# EAGLE board distribution_board_v3 (EAGLE 8.4.2)
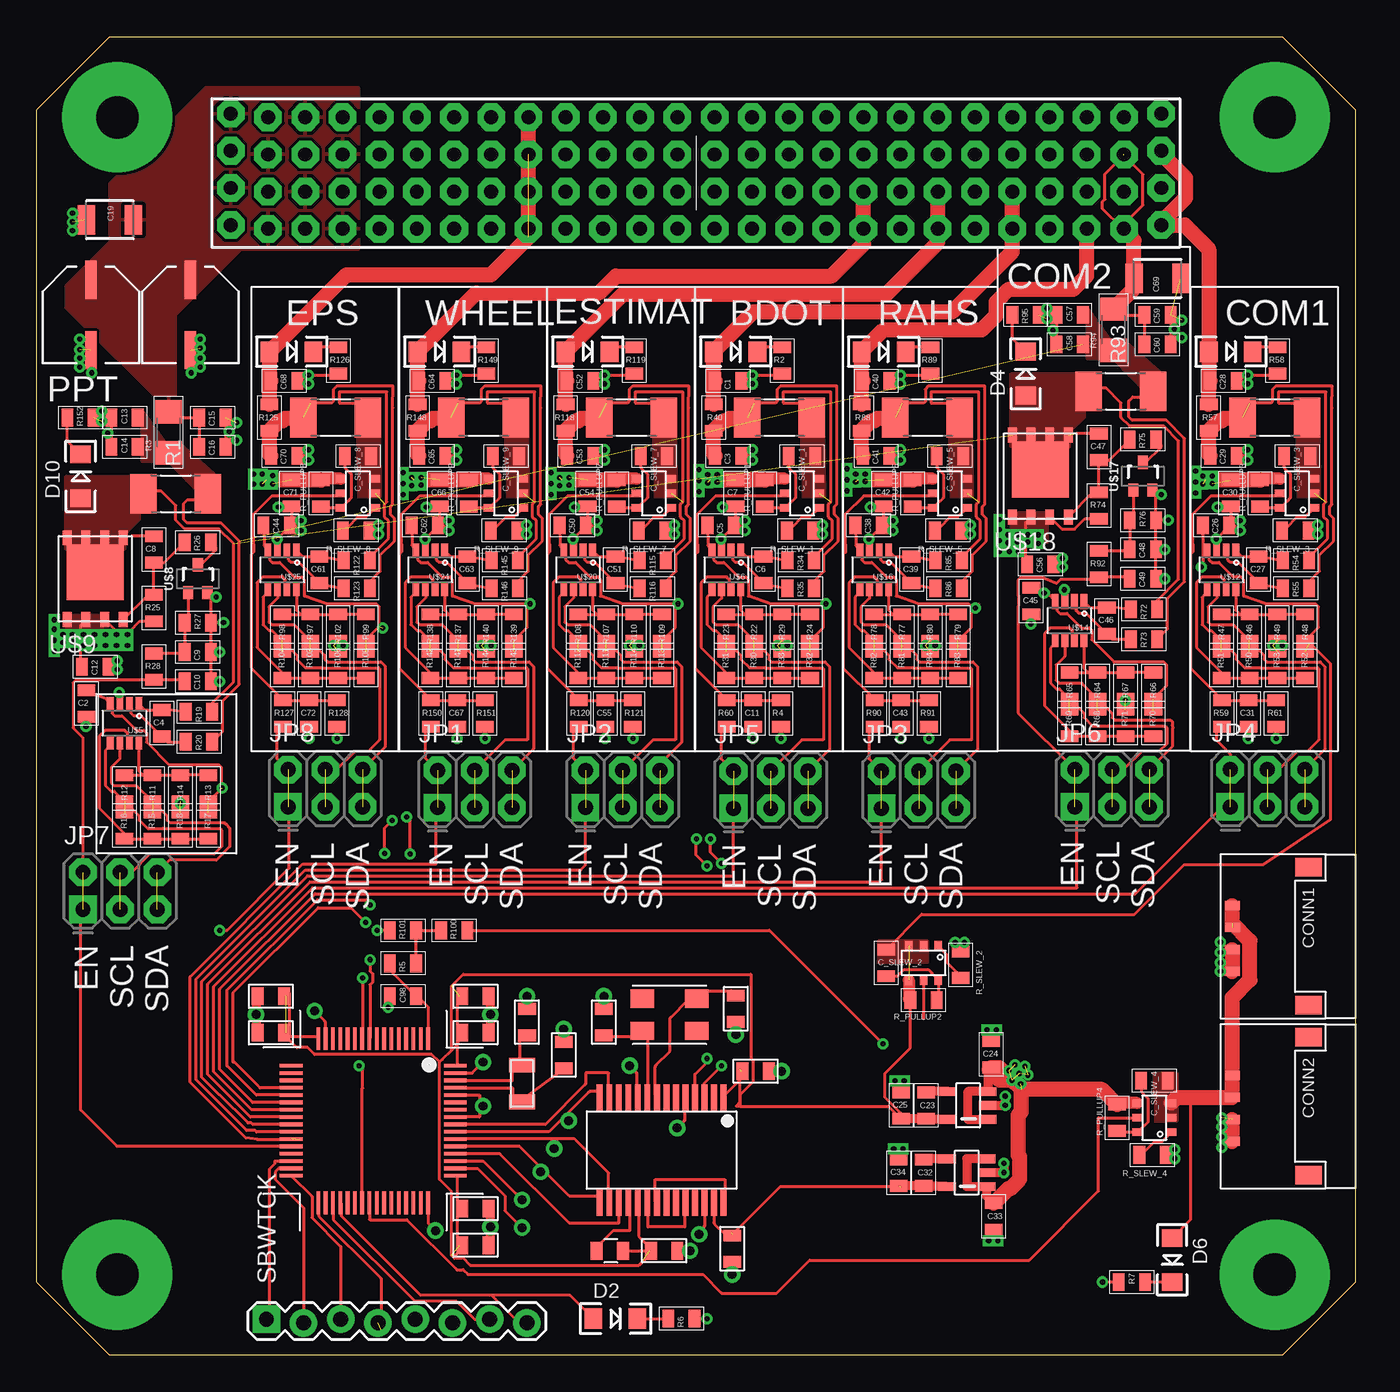
[diagram p3: board, top side]
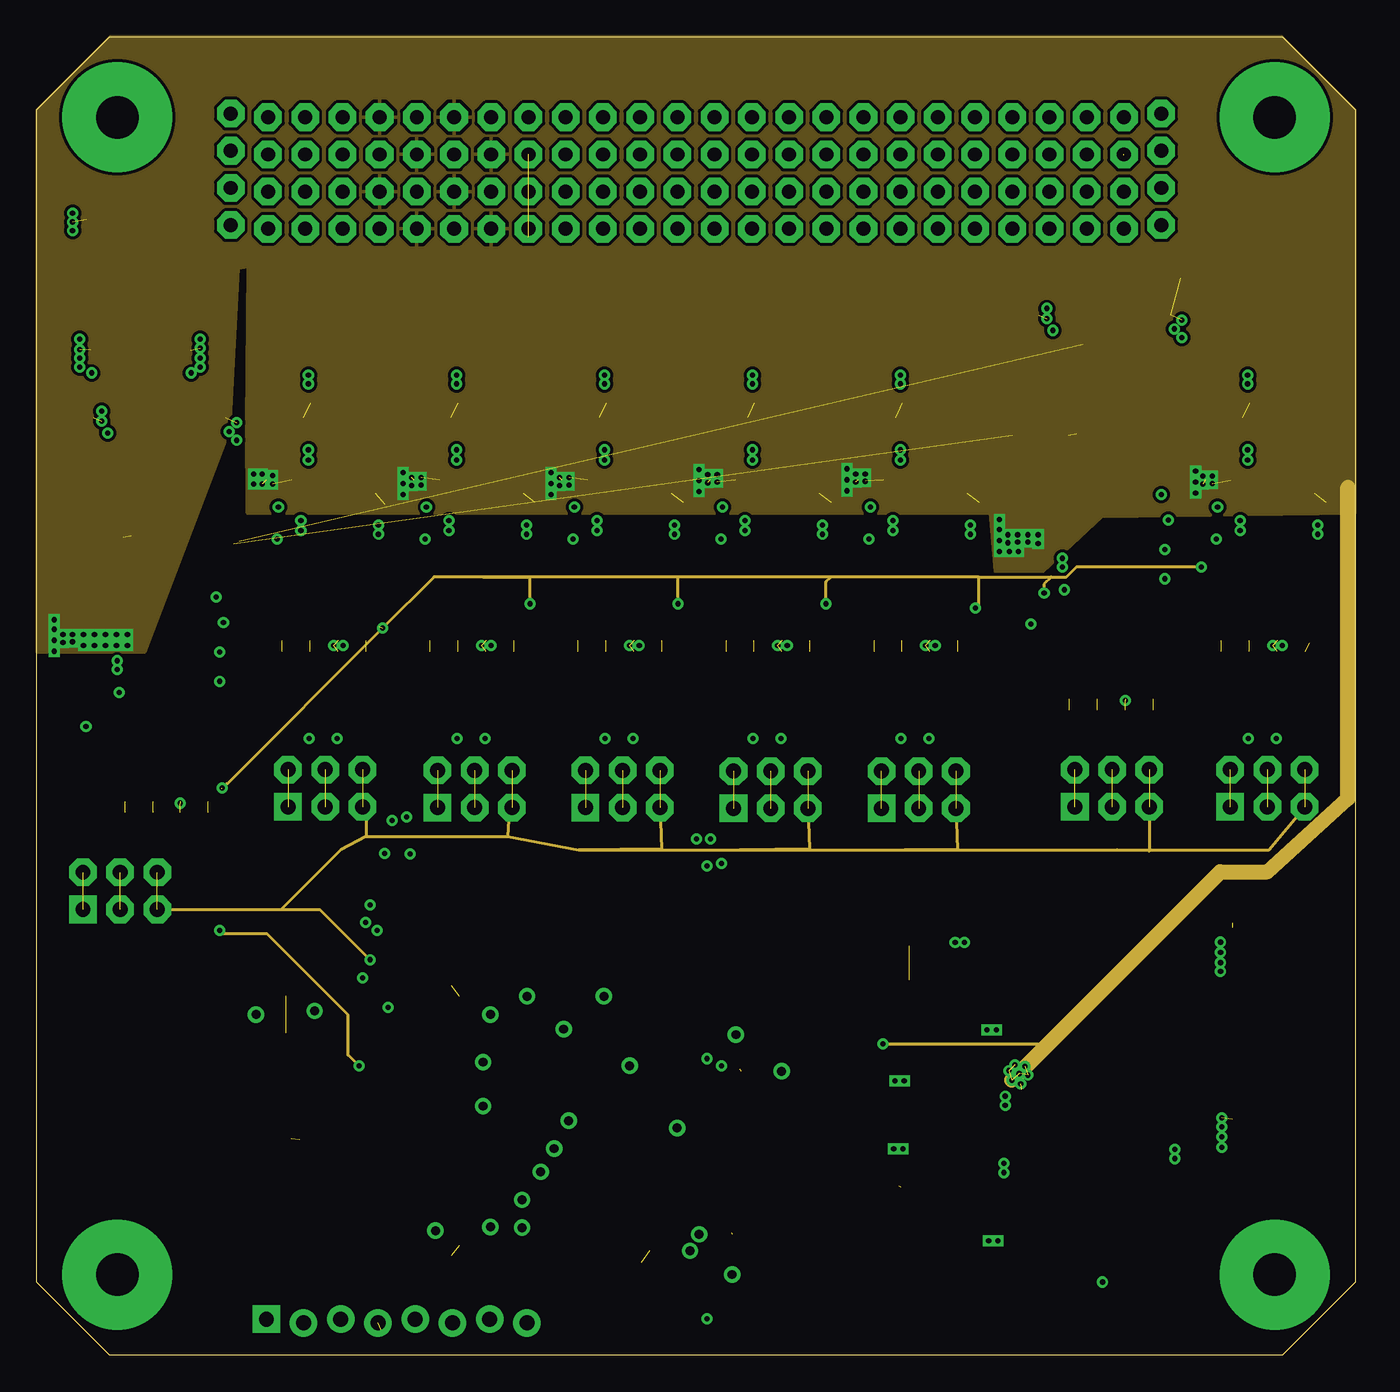
[diagram p4: board, inner layer Route2]
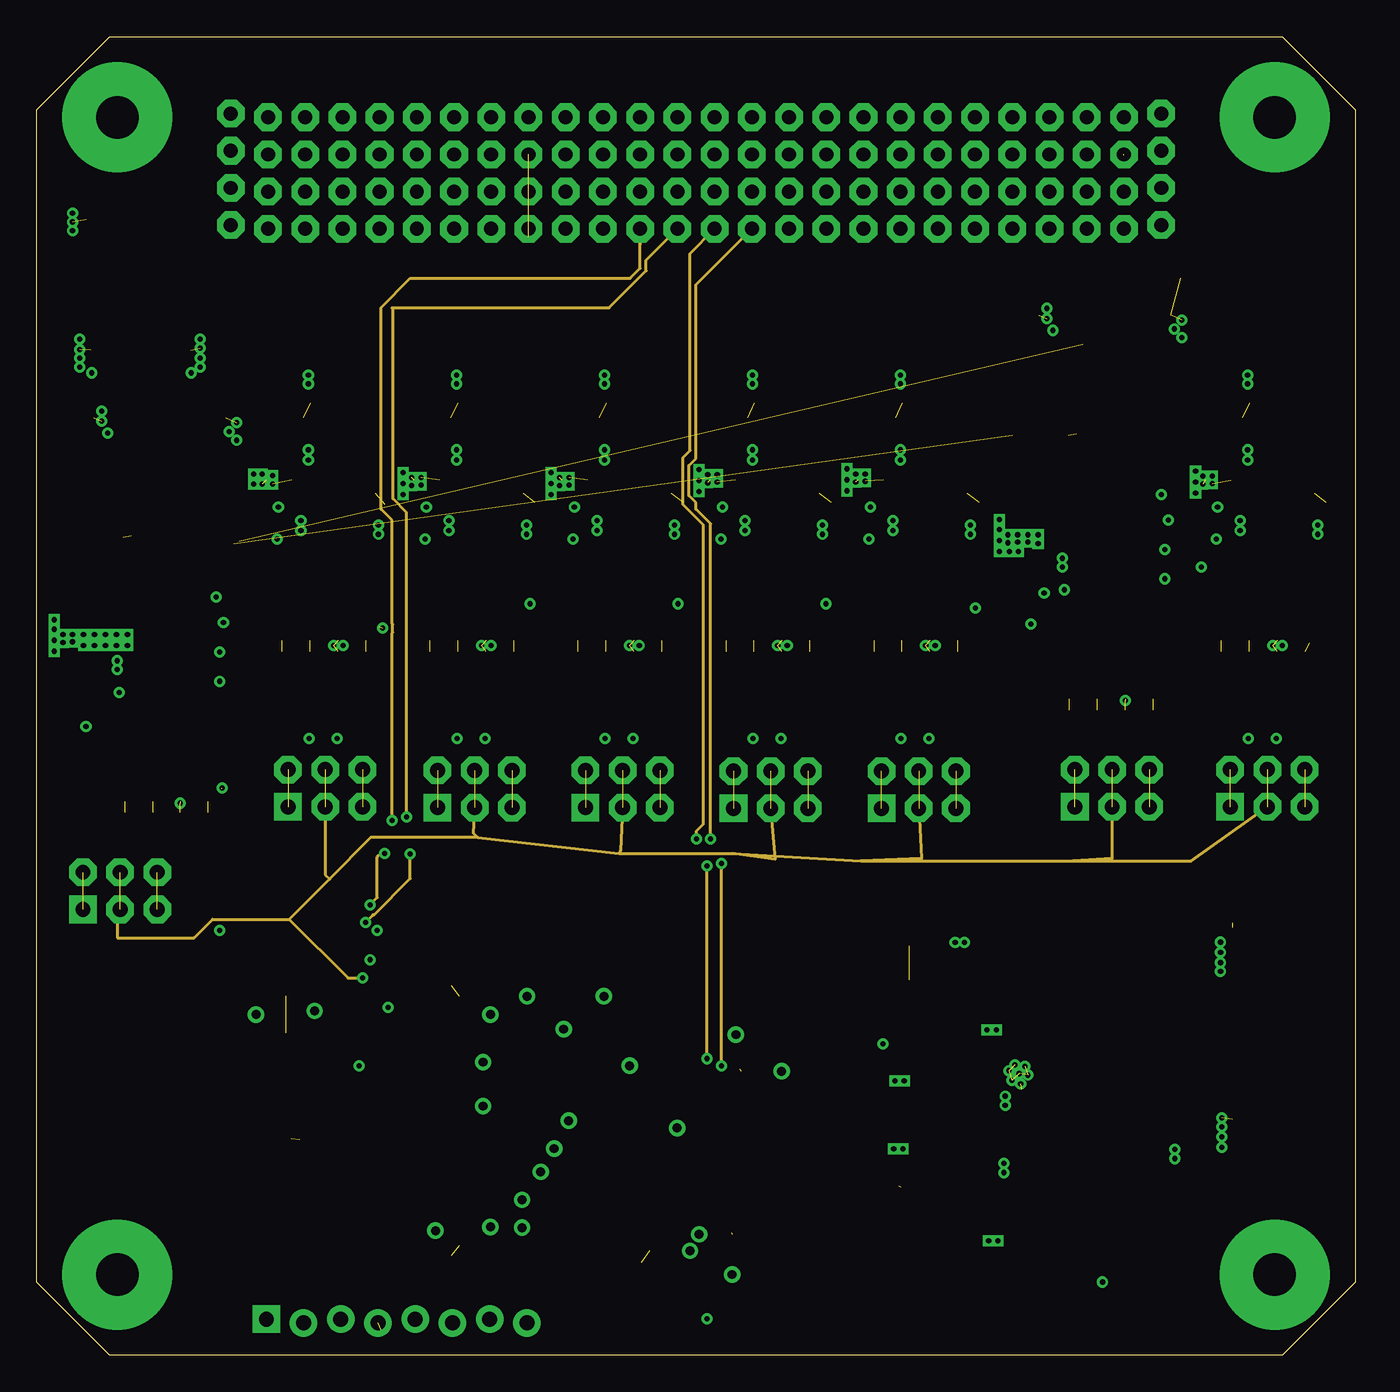
[diagram p5: board, inner layer Route3]
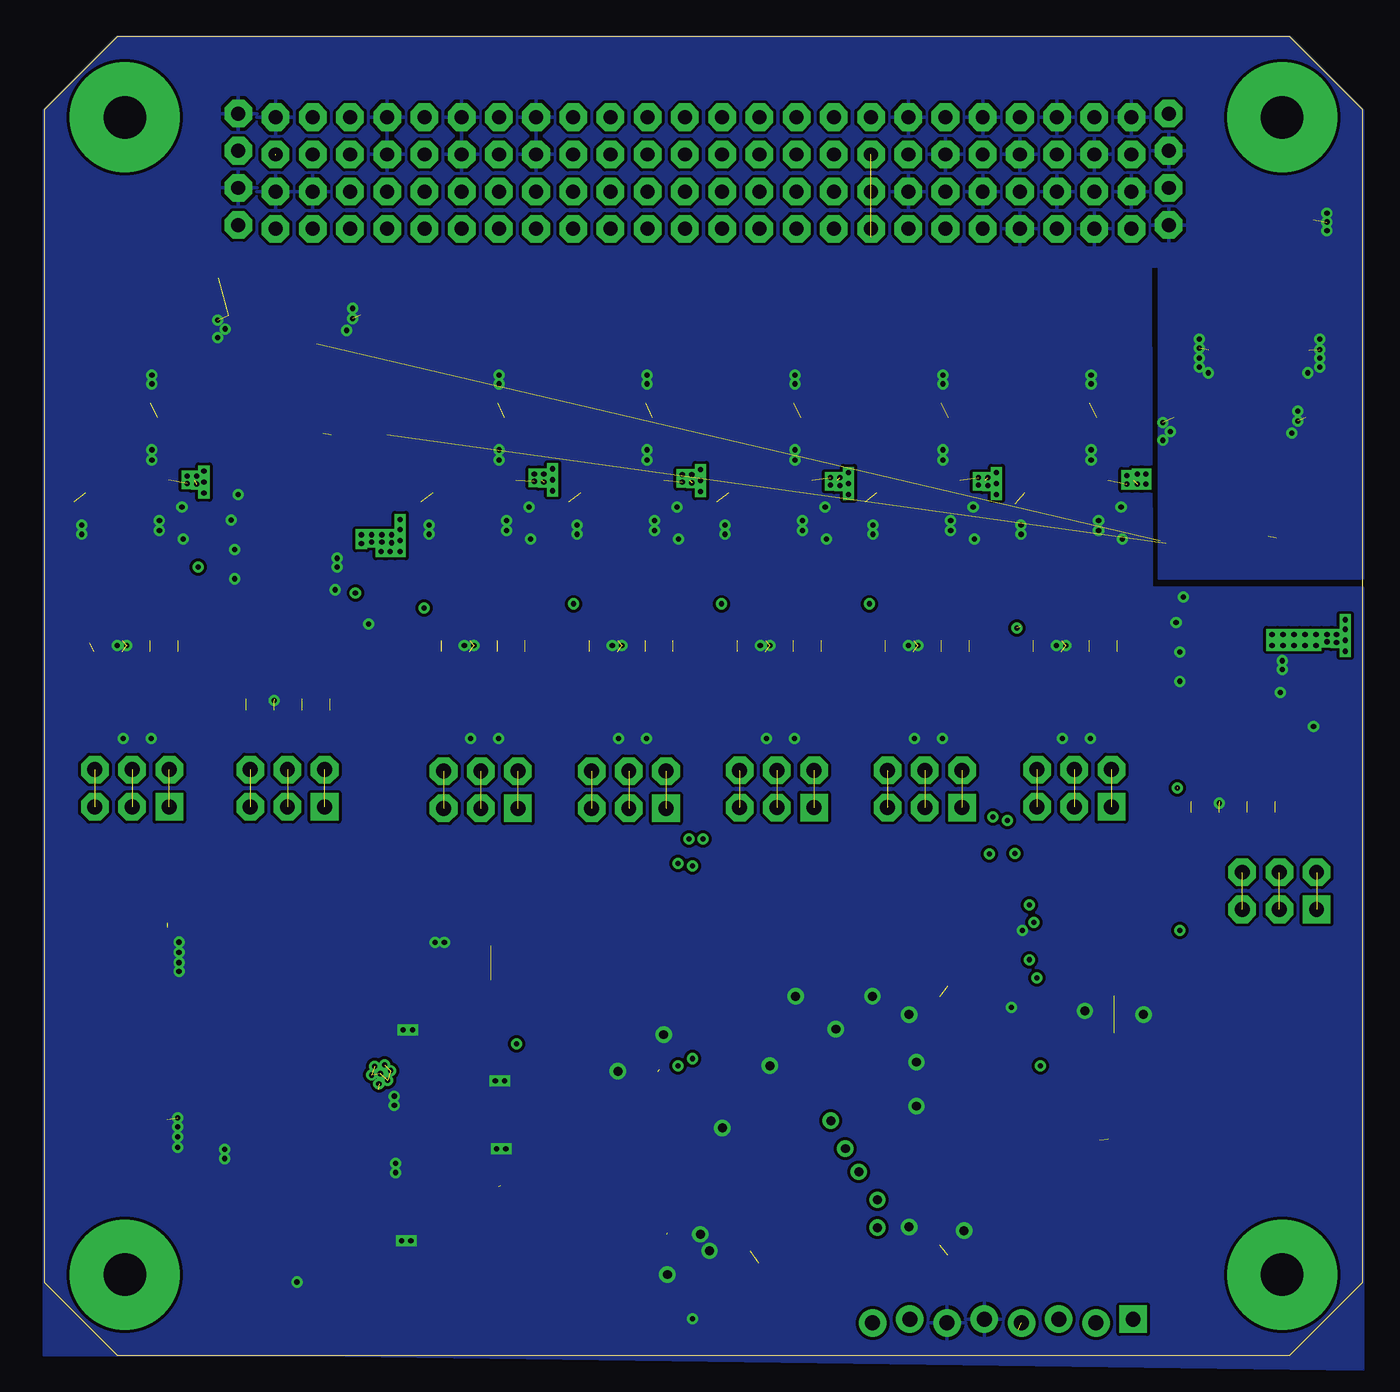
[diagram p6: board, bottom side, seen from below]

Size 90 x 90 mm. Coordinates in mm from the lower left corner, seen from the top.
Copper layers (1*2*3*16): Top 0.035mm / dielectric 1.5mm / Route2 0.035mm / dielectric 0.15mm / Route3 0.035mm / dielectric 0.2mm / Bottom 0.035mm
Design rules "default *": minimum track width 6mil, minimum drill 0.35mm, track to track 8mil, track to pad 8mil, pad to pad 8mil, via to via 8mil, smd to smd 8mil, copper to edge 0mil, drill to drill 8mil, minimum pad ring 10mil, minimum via ring 8mil, stop-mask expansion 4mil, vias tented up to drill 0mil, thermal gap 10mil

## Footprints (pad centres in the part's own frame; a part is rotated, then mirrored left to right if it is on the bottom)
MSP-CAN_BLOCK = smd 1.2 x 0.8: 1 -6,6.08; 2 -6,7.88; 3 -8.5,6.08; 4 -8.5,7.88; 9 -8.5,-6.08; 10 -8.5,-7.88; 11 -6,-6.08; 12 -6,-7.88; 13 8.5,6.08; 14 8.5,7.88; 15 6,6.08; 16 6,7.88; 23 8.875,18.955; 24 8.875,20.755; 25 8.875,17.045; 26 8.875,15.245; 27 -3.375,25.205; 28 -3.375,27.005 | smd 1 x 0.25: 3.3V@CAN1 -3.375,25.125; 3.3V@CAN2 8.875,18.875; 3.3V@MSP1 8.501,5.884; 3.3V@MSP2 -8.533,-5.962; 3.3V_ANALOG@MSP2 -8.482,5.904 | smd 0.8 x 1.2: 5 -5.83,10.5; 6 -7.63,10.5; 7 -3.58,13; 8 -5.38,13; 17 -8.545,24.75; 18 -6.745,24.75; 19 -5.83,15.75; 20 -7.63,15.75; 21 7.83,24.5; 22 9.63,24.5 | smd 0.25 x 1: 5V 7.65,24.5 | smd 1.75 x 0.4: CANH -1.6,21.96; CANL -1.6,22.61; P$65 -1.6,23.91; P$66 -1.6,23.26; P$69 -1.6,21.31; P$70 -1.6,20.66; P$71 -1.6,20.01; P$72 -1.6,19.36; P$73 -1.6,18.71; P$74 -1.6,18.06; P$75 -1.6,17.41; P$76 -1.6,16.76; P$77 -1.6,16.11; P$78 -1.6,15.46; P$79 5.6,15.46; P$80 5.6,16.11; P$81 5.6,16.76; P$82 5.6,17.41; P$83 5.6,18.06; P$84 5.6,18.71; P$85 5.6,19.36; P$86 5.6,20.01; P$87 5.6,20.66; P$88 5.6,21.31; P$89 5.6,21.96; P$90 5.6,22.61; P$91 5.6,23.26; P$92 5.6,23.91 | drill 0.61: GND@1 -3.375,27.875; GND@2 -5.875,24.75; GND@3 -3.75,17.5; GND@4 0.5,20.75; GND@5 -8.5,15.75; GND@7 -8.5,10.5; GND@8 -7.25,8; GND@9 -4,7.5; GND@10 -1,7.5; GND@11 7.75,22.25; GND@12 10.5,24.5; GND@13 8.875,21.625; GND@14 7.25,8; GND@15 7.5,4.25; GND@16 -7.5,-4; GND@17 -7.25,-8; GND@26 -6.25,13; P2.4_SPI-CS2 5.397,10.16; P2.7_SPI-CS3 7.303,10.16; P5.4_SPI-MOSI 3.487,11.434; P5.5_SPI-MISO 1.9,12.354; P5.6_SPI-CLK 0,13.348 | smd 1.55 x 0.25: P1.0_A0 -5.6,3.75; P1.1_A1 -5.6,3.25; P1.2_A2 -5.6,2.75; P1.3_A3 -5.6,-1.75; P1.4_A4 -5.6,-2.25; P1.5_A5 -5.6,-2.75; P1.6_GPIO/PWM 5.6,-0.75; P1.7_GPIO/PWM 5.6,-0.25; P2.1_RXD 5.6,-3.75; P2.2_GPIO/PWM 5.6,-3.25; P3.0_A12 -5.6,2.25; P3.1_A13 -5.6,1.75; P3.2_A14 -5.6,1.25; P3.3_A15 -5.6,0.75; P3.4_GPIO_DEBUG 5.6,-2.75; P3.5_GPIO_DEBUG 5.6,-2.25; P3.6_GPIO/PWM 5.6,-1.75; P3.7_GPIO/PWM 5.6,-1.25; P5.0_I2C-SDA-1 5.6,0.25; P5.1_I2C-SCL-1 5.6,0.75; P7.0_I2C-SDA-2 -5.6,-0.25; P7.1_I2C-SCL-2 -5.6,-0.75; P$8 -5.6,0.25; P$11 -5.6,-1.25; P$15 -5.6,-3.25; P$16 -5.6,-3.75; P$43 5.6,1.25; P$44 5.6,1.75; P$45 5.6,2.25; P$46 5.6,2.75; P$47 5.6,3.25; P$48 5.6,3.75 | smd 0.25 x 1.55: P2.0_TXD 3.75,-5.6; P2.5_GPIO 1.75,-5.6; P2.6_GPIO/PWM 2.25,-5.6; P4.0_GPIO -0.25,-5.6; P4.1_GPIO 0.25,-5.6; P4.2_GPIO 0.75,-5.6; P4.3_GPIO 1.25,-5.6; P7.2_SYNC1 -1.75,-5.6; P7.3_GPIO -1.25,-5.6; P7.4_GPIO -0.75,-5.6; P$17 -3.75,-5.6; P$18 -3.25,-5.6; P$19 -2.75,-5.6; P$49 3.75,5.6; P$50 3.25,5.6; P$51 2.75,5.6; P$52 2.25,5.6; P$53 1.75,5.6; P$54 1.25,5.6; P$55 0.75,5.6; P$56 0.25,5.6; P$57 -0.25,5.6; P$58 -0.75,5.6; P$59 -1.25,5.6; P$60 -1.75,5.6; P$61 -2.25,5.6; P$62 -2.75,5.6; P$63 -3.25,5.6; P$64 -3.75,5.6; PJ.3_SYNC2 -2.25,-5.6; SBWTCK 2.75,-5.6; SBWTDIO 3.25,-5.6 | smd 1 x 1.8: P$93 -3.79,10.16; P$94 -1.29,10.16 | smd 1.25 x 1.6: P$104 -6.13,18.38; P$105 -6.13,22.08; P$106 -8.33,22.08; P$107 -8.33,18.38
0805 = smd 0.8 x 1.2: 1 -0.9,0; 2 0.9,0
PANASONIC_SVPG = smd 0.8 x 2.6: NEG 0,2.4; POS 0,-2.4
1210 = smd 1.2 x 2: 1 -1.6,0; 2 1.6,0
PICOLOCK_4 = smd 1.25 x 1.8: MNT@1 -2.605,5.2; MNT@2 6.805,5.2 | smd 0.6 x 1: P$1 0,0; P$2 1.5,0; P$3 3,0; P$4 4.5,0
LED-1206 = smd 1.2 x 1.4: A -1.5,0; C 1.5,0
2X3-NS = drill 1.016 pad 1.88 square: 1 -2.54,-1.27 | drill 1.016 pad 1.88 octagon: 2 -2.54,1.27; 3 0,-1.27; 4 0,1.27; 5 2.54,-1.27; 6 2.54,1.27
R2010 = smd 1.8 x 2.7: 1 -2.2,0; 2 2.2,0
1206 = smd 1.6 x 1.8: 1 -1.4,0; 2 1.4,0
SOT-23-5 = smd 0.6 x 1.2: P$1 -0.95,-1.35; P$2 0,-1.35; P$3 0.95,-1.35; P$4 0.95,1.35; P$5 -0.95,1.35
1X08_CONNECTOR = drill 1.016 pad 1.88: 2 2.54,-0.127; 3 5.08,0.127; 4 7.62,-0.127; 5 10.16,0.127; 6 12.7,-0.127; 7 15.24,0.127; 8 17.78,-0.127 | drill 1.016 pad 1.88 square: SBWTCK 0,0.127
PC104_CONNECTOR = drill 0.953 pad 1.88 octagon: P$1 -31.75,32.134; P$2 -31.75,34.674; P$3 -31.75,37.214; P$4 -31.75,39.754; P$5 -29.21,31.88; P$6 -29.21,34.42; P$7 -29.21,36.96; P$8 -29.21,39.5; P$9 -26.67,31.88; P$10 -26.67,34.42; P$11 -26.67,36.96; P$12 -26.67,39.5; P$13 -24.13,31.88; P$14 -24.13,34.42; P$15 -24.13,36.96; P$16 -24.13,39.5; P$17 -21.59,31.88; P$18 -21.59,34.42; P$19 -21.59,36.96; P$20 -21.59,39.5; P$21 -19.05,31.88; P$22 -19.05,34.42; P$23 -19.05,36.96; P$24 -19.05,39.5; P$25 -16.51,31.88; P$26 -16.51,34.42; P$27 -16.51,36.96; P$28 -16.51,39.5; P$29 -13.97,31.88; P$30 -13.97,34.42; P$31 -13.97,36.96; P$32 -13.97,39.5; P$33 -11.43,31.88; P$34 -11.43,34.42; P$35 -11.43,36.96; P$36 -11.43,39.5; P$37 -8.89,31.88; P$38 -8.89,34.42; P$39 -8.89,36.96; P$40 -8.89,39.5; P$41 -6.35,31.88; P$42 -6.35,34.42; P$43 -6.35,36.96; P$44 -6.35,39.5; P$45 -3.81,31.88; P$46 -3.81,34.42; P$47 -3.81,36.96; P$48 -3.81,39.5; P$49 -1.27,31.88; P$50 -1.27,34.42; P$51 -1.27,36.96; P$52 -1.27,39.5; P$53 1.27,31.88; P$54 1.27,34.42; P$55 1.27,36.96; P$56 1.27,39.5; P$57 3.81,31.88; P$58 3.81,34.42; P$59 3.81,36.96; P$60 3.81,39.5; P$61 6.35,31.88; P$62 6.35,34.42; P$63 6.35,36.96; P$64 6.35,39.5; P$65 8.89,31.88; P$66 8.89,34.42; P$67 8.89,36.96; P$68 8.89,39.5; P$69 11.43,31.88; P$70 11.43,34.42; P$71 11.43,36.96; P$72 11.43,39.5; P$73 13.97,31.88; P$74 13.97,34.42; P$75 13.97,36.96; P$76 13.97,39.5; P$77 16.51,31.88; P$78 16.51,34.42; P$79 16.51,36.96; P$80 16.51,39.5; P$81 19.05,31.88; P$82 19.05,34.42; P$83 19.05,36.96; P$84 19.05,39.5; P$85 21.59,31.88; P$86 21.59,34.42; P$87 21.59,36.96; P$88 21.59,39.5; P$89 24.13,31.88; P$90 24.13,34.42; P$91 24.13,36.96; P$92 24.13,39.5; P$93 26.67,31.88; P$94 26.67,34.42; P$95 26.67,36.96; P$96 26.67,39.5; P$97 29.21,31.88; P$98 29.21,34.42; P$99 29.21,36.96; P$100 29.21,39.5; P$101 31.75,32.134; P$102 31.75,34.674; P$103 31.75,37.214; P$104 31.75,39.754
BOARD_TEMPLATE = drill 2.9 pad 7.5: P$1 -39.5,39.5; P$2 -39.5,-39.5; P$3 39.5,-39.5; P$4 39.5,39.5
SOT-23-8 = smd 0.45 x 1: 1 -0.975,-1.3; 2 -0.325,-1.3; 3 0.325,-1.3; 4 0.975,-1.3; 5 0.975,1.3; 6 0.325,1.3; 7 -0.325,1.3; 8 -0.975,1.3
TSOP-6 = smd 0.508 x 0.7: P$1 -1,-1.162; P$2 0,-1.162; P$3 1,-1.162; P$4 1,1.162; P$5 0,1.162; P$6 -1,1.162
SOT-323 = smd 0.7 x 0.9: 1 -0.65,-0.95; 2 0.65,-0.95; 3 0,0.95
POWERDI5060-8 = smd 3.91 x 3.81: D1 0,0.44 | smd 0.61 x 1.02: D2 -1.905,2.795; D3 -0.635,2.795; D4 0.635,2.795; D5 1.905,2.795; G 1.905,-2.795; S1 -1.905,-2.795; S2 -0.635,-2.795; S3 0.635,-2.795

## Placement (x,y rotation side)
BLK1  MSP-CAN_BLOCK  [MSP-CAN_BLOCK]  22.97,16.01 270 top
C1  1u  [0805]  47.2,66.5 0 top
C2  .1u  [0805]  3.39,44.48 270 top
C3  1u  [0805]  47.2,61.4 0 top
C4  1u  [0805]  8.54,43.14 270 top
C5  .1u  [0805]  46.69,56.66 0 top
C6  1u  [0805]  49.61,53.61 270 top
C7  1u  [0805]  47.7,58.85 270 top
C8  .1u  [0805]  8,55 270 top
C9  DNP  [0805]  11,48 0 top
C10  DNP  [0805]  11,46 0 top
C11  .1u  [0805]  48.9,43.8 270 top
C12  1u  [0805]  4,47 0 top
C13  .1u  [0805]  6,64 180 top
C14  1u  [0805]  6,62 180 top
C15  .1u  [0805]  12,64 0 top
C16  1u  [0805]  12,62 0 top
C17  82u  [PANASONIC_SVPG]  3.7,71 180 top
C18  82u  [PANASONIC_SVPG]  10.5,71 180 top
C19  10u  [1210]  5,77.5 180 top
C23  .1u  [0805]  60.71,17.05 90 top
C24  1 μF  [0805]  65.15,20.55 270 top
C25  1 μF  [0805]  58.99,17.05 270 top
C26  .1u  [0805]  80.49,56.66 0 top
C27  1u  [0805]  83.41,53.61 270 top
C28  1u  [0805]  81,66.5 0 top
C29  1u  [0805]  81,61.4 0 top
C30  1u  [0805]  81.5,58.85 270 top
C31  .1u  [0805]  82.7,43.8 270 top
C32  .1u  [0805]  60.55,12.47 90 top
C33  1 μF  [0805]  65.32,9.48 90 top
C34  1μF  [0805]  58.84,12.47 270 top
C38  .1u  [0805]  56.79,56.66 0 top
C39  1u  [0805]  59.71,53.61 270 top
C40  1u  [0805]  57.3,66.5 0 top
C41  1u  [0805]  57.3,61.4 0 top
C42  1u  [0805]  57.8,58.85 270 top
C43  .1u  [0805]  59,43.8 270 top
C44  .1u  [0805]  16.39,56.66 0 top
C45  .1u  [0805]  67.89,51.48 270 top
C46  1u  [0805]  73.04,50.14 270 top
C47  .1u  [0805]  72.5,62 270 top
C48  DNP  [0805]  75.5,55 0 top
C49  DNP  [0805]  75.5,53 0 top
C50  .1u  [0805]  36.59,56.66 0 top
C51  1u  [0805]  39.51,53.61 270 top
C52  1u  [0805]  37.1,66.5 0 top
C53  1u  [0805]  37.1,61.4 0 top
C54  1u  [0805]  37.6,58.85 270 top
C55  .1u  [0805]  38.8,43.8 270 top
C56  1u  [0805]  68.5,54 0 top
C57  .1u  [0805]  70.5,71 180 top
C58  1u  [0805]  70.5,69 180 top
C59  .1u  [0805]  76.5,71 0 top
C60  1u  [0805]  76.5,69 0 top
C61  1u  [0805]  19.31,53.61 270 top
C62  .1u  [0805]  26.49,56.66 0 top
C63  1u  [0805]  29.41,53.61 270 top
C64  1u  [0805]  27,66.5 0 top
C65  1u  [0805]  27,61.4 0 top
C66  1u  [0805]  27.5,58.85 270 top
C67  .1u  [0805]  28.7,43.8 270 top
C68  1u  [0805]  16.9,66.5 0 top
C69  10u  [1210]  76.5,73.5 0 top
C70  1u  [0805]  16.9,61.4 0 top
C71  1u  [0805]  17.4,58.85 270 top
C72  .1u  [0805]  18.6,43.8 270 top
C98  .1u  [0805]  25,24.5 180 top
C_SLEW_1  .1u  [0805]  52.23,61.37 180 top
C_SLEW_2  .1u  [0805]  57.99,26.78 270 top
C_SLEW_3  .1u  [0805]  86.03,61.37 180 top
C_SLEW_4  .1u  [0805]  76.28,18.76 180 top
C_SLEW_5  .1u  [0805]  62.33,61.37 180 top
C_SLEW_7  .1u  [0805]  42.13,61.37 180 top
C_SLEW_8  .1u  [0805]  21.93,61.37 180 top
C_SLEW_9  .1u  [0805]  32.03,61.37 180 top
CONN1  PICOLOCK_4  [PICOLOCK_4]  81.6,30.7 270 top
CONN2  PICOLOCK_4  [PICOLOCK_4]  81.6,19.1 270 top
D1  [LED-1206]  47.7,68.5 0 top
D2  [LED-1206]  39.5,2.5 0 top
D3  [LED-1206]  81.5,68.5 0 top
D4  [LED-1206]  67.5,67 90 top
D5  [LED-1206]  57.8,68.5 0 top
D6  [LED-1206]  77.5,6.5 270 top
D7  [LED-1206]  37.6,68.5 0 top
D9  [LED-1206]  27.5,68.5 0 top
D10  [LED-1206]  3,60 90 top
D11  [LED-1206]  17.4,68.5 0 top
JP1  [2X3-NS]  29.9,38.65 0 top
JP2  [2X3-NS]  40,38.65 0 top
JP3  [2X3-NS]  60.2,38.6 0 top
JP4  [2X3-NS]  84,38.7 0 top
JP5  [2X3-NS]  50.1,38.6 0 top
JP6  [2X3-NS]  73.4,38.7 0 top
JP7  [2X3-NS]  5.7,31.7 0 top
JP8  [2X3-NS]  19.7,38.7 0 top
R1  .02  [R2010]  9.5,58.8 0 top
R2  500  [0805]  50.9,67.9 270 top
R3  [1206]  9,63 90 top
R4  100k  [0805]  50.8,43.8 270 top
R5  100  [0805]  25,26.75 0 top
R6  500  [0805]  44,2.5 0 top
R7  5000  [0805]  74.75,5 180 top
R11  DNP  [0805]  7.91,38.7 270 top
R12  DNP  [0805]  6,38.7 270 top
R13  DNP  [0805]  11.72,38.7 270 top
R14  0  [0805]  9.81,38.7 270 top
R15  DNP  [0805]  7.91,36.16 90 top
R16  DNP  [0805]  6,36.16 90 top
R17  0  [0805]  11.72,36.16 90 top
R18  DNP  [0805]  9.81,36.16 90 top
R19  10  [0805]  11.08,43.91 0 top
R20  10  [0805]  11.08,41.87 0 top
R22  DNP  [0805]  48.97,49.67 270 top
R23  DNP  [0805]  47.07,49.67 270 top
R24  DNP  [0805]  52.78,49.67 270 top
R25  1M  [0805]  8,51 270 top
R26  20k  [0805]  11,55.5 0 top
R27  100k  [0805]  11,50 180 top
R28  100  [0805]  8,47 270 top
R29  0  [0805]  50.88,49.67 270 top
R30  0  [0805]  48.97,47.13 90 top
R31  DNP  [0805]  47.07,47.13 90 top
R32  DNP  [0805]  52.78,47.13 90 top
R33  DNP  [0805]  50.88,47.13 90 top
R34  10  [0805]  52.15,54.25 0 top
R35  10  [0805]  52.15,52.34 0 top
R36  .1  [R2010]  50.7,64 0 top
R40  DNP  [0805]  46.2,64 90 top
R46  DNP  [0805]  82.77,49.67 270 top
R47  DNP  [0805]  80.87,49.67 270 top
R48  DNP  [0805]  86.58,49.67 270 top
R49  0  [0805]  84.68,49.67 270 top
R50  DNP  [0805]  82.77,47.13 90 top
R51  0  [0805]  80.87,47.13 90 top
R52  DNP  [0805]  86.58,47.13 90 top
R53  DNP  [0805]  84.68,47.13 90 top
R54  10  [0805]  85.95,54.25 0 top
R55  10  [0805]  85.95,52.34 0 top
R56  .1  [R2010]  84.5,64 0 top
R57  DNP  [0805]  80,64 90 top
R58  500  [0805]  84.7,67.9 270 top
R59  100  [0805]  80.9,43.8 270 top
R60  100  [0805]  47.1,43.8 270 top
R61  100k  [0805]  84.6,43.8 270 top
R64  DNP  [0805]  72.41,45.7 270 top
R65  DNP  [0805]  70.5,45.7 270 top
R66  DNP  [0805]  76.22,45.7 270 top
R67  0  [0805]  74.31,45.7 270 top
R68  DNP  [0805]  72.41,43.16 90 top
R69  DNP  [0805]  70.5,43.16 90 top
R70  DNP  [0805]  76.22,43.16 90 top
R71  0  [0805]  74.31,43.16 90 top
R72  10  [0805]  75.58,50.91 0 top
R73  10  [0805]  75.58,48.87 0 top
R74  1M  [0805]  72.5,58 270 top
R75  20k  [0805]  75.5,62.5 0 top
R76  100k  [0805]  75.5,57 180 top
R77  DNP  [0805]  59.07,49.67 270 top
R78  DNP  [0805]  57.17,49.67 270 top
R79  0  [0805]  62.88,49.67 270 top
R80  DNP  [0805]  60.98,49.67 270 top
R81  DNP  [0805]  59.07,47.13 90 top
R82  DNP  [0805]  57.17,47.13 90 top
R83  DNP  [0805]  62.88,47.13 90 top
R84  0  [0805]  60.98,47.13 90 top
R85  10  [0805]  62.25,54.25 0 top
R86  10  [0805]  62.25,52.34 0 top
R87  .1  [R2010]  60.8,64 0 top
R88  DNP  [0805]  56.3,64 90 top
R89  500  [0805]  61,67.9 270 top
R90  100  [0805]  57.2,43.8 270 top
R91  100k  [0805]  60.9,43.8 270 top
R92  100  [0805]  72.5,54 270 top
R93  .02  [R2010]  74,65.8 0 top
R94  [1206]  73.5,70 90 top
R95  500  [0805]  67.5,71 0 top
R97  DNP  [0805]  18.67,49.67 270 top
R98  DNP  [0805]  16.77,49.67 270 top
R99  0  [0805]  22.48,49.67 270 top
R100  100k  [0805]  28.5,29 0 top
R101  53k  [0805]  25,29 0 top
R102  DNP  [0805]  20.58,49.67 270 top
R103  0  [0805]  18.67,47.13 90 top
R104  DNP  [0805]  16.77,47.13 90 top
R105  DNP  [0805]  22.48,47.13 90 top
R106  DNP  [0805]  20.58,47.13 90 top
R107  DNP  [0805]  38.87,49.67 270 top
R108  DNP  [0805]  36.97,49.67 270 top
R109  0  [0805]  42.68,49.67 270 top
R110  DNP  [0805]  40.78,49.67 270 top
R111  DNP  [0805]  38.87,47.13 90 top
R112  DNP  [0805]  36.97,47.13 90 top
R113  0  [0805]  42.68,47.13 90 top
R114  DNP  [0805]  40.78,47.13 90 top
R115  10  [0805]  42.05,54.25 0 top
R116  10  [0805]  42.05,52.34 0 top
R117  .1  [R2010]  40.6,64 0 top
R118  DNP  [0805]  36.1,64 90 top
R119  500  [0805]  40.8,67.9 270 top
R120  100  [0805]  37,43.8 270 top
R121  100k  [0805]  40.7,43.8 270 top
R122  10  [0805]  21.85,54.25 0 top
R123  10  [0805]  21.85,52.34 0 top
R124  .1  [R2010]  20.4,64 0 top
R125  DNP  [0805]  15.9,64 90 top
R126  500  [0805]  20.6,67.9 270 top
R127  100  [0805]  16.8,43.8 270 top
R128  100k  [0805]  20.5,43.8 270 top
R137  DNP  [0805]  28.77,49.67 270 top
R138  0  [0805]  26.87,49.67 270 top
R139  DNP  [0805]  32.58,49.67 270 top
R140  DNP  [0805]  30.68,49.67 270 top
R141  0  [0805]  28.77,47.13 90 top
R142  DNP  [0805]  26.87,47.13 90 top
R143  DNP  [0805]  32.58,47.13 90 top
R144  DNP  [0805]  30.68,47.13 90 top
R145  10  [0805]  31.95,54.25 0 top
R146  10  [0805]  31.95,52.34 0 top
R147  .1  [R2010]  30.5,64 0 top
R148  DNP  [0805]  26,64 90 top
R149  500  [0805]  30.7,67.9 270 top
R150  100  [0805]  26.9,43.8 270 top
R151  100k  [0805]  30.6,43.8 270 top
R152  500  [0805]  3,64 0 top
R_PULLUP1  100k  [0805]  49.69,58.83 90 top
R_PULLUP2  100k  [0805]  60.53,24.24 180 top
R_PULLUP3  100k  [0805]  83.49,58.83 90 top
R_PULLUP4  100k  [0805]  73.74,16.22 90 top
R_PULLUP5  100k  [0805]  59.79,58.83 90 top
R_PULLUP7  100k  [0805]  39.59,58.83 90 top
R_PULLUP8  100k  [0805]  19.39,58.83 90 top
R_PULLUP9  100k  [0805]  29.49,58.83 90 top
R_SLEW_1  5k  [0805]  52.1,56.29 180 top
R_SLEW_2  5k  [0805]  63.07,26.65 270 top
R_SLEW_3  5k  [0805]  85.9,56.29 180 top
R_SLEW_4  5k  [0805]  76.15,13.68 180 top
R_SLEW_5  5k  [0805]  62.2,56.29 180 top
R_SLEW_7  5k  [0805]  42,56.29 180 top
R_SLEW_8  5k  [0805]  21.8,56.29 180 top
R_SLEW_9  5k  [0805]  31.9,56.29 180 top
U2  TPS732XX  [SOT-23-5]  63.56,17.05 90 top
U3  TPS732XX  [SOT-23-5]  63.48,12.47 90 top
U$1  PROGRAM/DEBUG_PORT  [1X08_CONNECTOR]  15.68,2.34 0 top
U$2  PC104_CONNECTOR  [PC104_CONNECTOR]  45,45 0 top
U$3  BOARD_TEMPLATE1  [BOARD_TEMPLATE]  45,45 0 top
U$5  INA219  [SOT-23-8]  6,43.14 180 top
U$6  INA219  [SOT-23-8]  47.07,53.61 180 top
U$7  SI3865DDV  [TSOP-6]  60.53,26.78 180 top
U$8  DMN5L06WK  [SOT-323]  11,53 0 top
U$9  DMP2002UPS  [POWERDI5060-8]  4,53 0 top
U$10  SI3865DDV  [TSOP-6]  86.03,58.83 90 top
U$11  SI3865DDV  [TSOP-6]  52.23,58.83 90 top
U$12  INA219  [SOT-23-8]  80.87,53.61 180 top
U$13  SI3865DDV  [TSOP-6]  76.28,16.22 90 top
U$14  INA219  [SOT-23-8]  70.5,50.14 180 top
U$15  SI3865DDV  [TSOP-6]  62.33,58.83 90 top
U$16  INA219  [SOT-23-8]  57.17,53.61 180 top
U$17  DMN5L06WK  [SOT-323]  75.5,60 0 top
U$18  DMP2002UPS  [POWERDI5060-8]  68.5,60 0 top
U$19  SI3865DDV  [TSOP-6]  42.13,58.83 90 top
U$20  INA219  [SOT-23-8]  36.97,53.61 180 top
U$22  SI3865DDV  [TSOP-6]  21.93,58.83 90 top
U$23  SI3865DDV  [TSOP-6]  32.03,58.83 90 top
U$24  INA219  [SOT-23-8]  26.87,53.61 180 top
U$25  INA219  [SOT-23-8]  16.77,53.61 180 top

## Tracks (layer width: path | path; a pad name or v marks a point on that pad's centre or on a via)
3.3V  (via drill 0.35)  (16 unrouted)
  Top 0.203: C2.1 4.75,44.82 U$5.4 5.15,44.32 5.15,43.81 5.32,43.64 5.83,43.64 6.82,42.65 7.33,42.65 7.51,42.47 7.51,41.84 9.05,40.3 12.44,40.3 12.62,40.12 12.62,38.7 R13.2 | C5.1 45.82,55.29 U$6.4 46.21,54.79 46.21,54.29 46.39,54.11 46.9,54.11 47.89,53.12 48.39,53.12 48.57,52.94 48.57,51.82 50.12,51.27 53.51,51.27 53.69,51.09 | R24.2 53.69,49.67 53.69,51.09 | 86.91,49.09 87.49,49.67 87.49,51.09 87.31,51.27 83.92,51.27 82.37,51.82 82.37,52.94 82.19,53.12 81.69,53.12 80.7,54.11 80.19,54.11 80.01,54.29 80.01,54.79 U$12.4 79.62,55.29 C26.1 79.59,53.84 79.5,53.75 v79.5,53.8 | 86.91,49.09 R48.2 | C38.1 55.92,55.29 U$16.4 56.31,54.79 56.31,54.29 56.49,54.11 57,54.11 57.99,53.12 58.49,53.12 58.67,52.94 58.67,51.82 60.22,51.27 63.61,51.27 63.79,51.09 | R79.2 63.79,49.67 63.79,51.09 | C50.1 35.72,55.29 U$20.4 36.11,54.79 36.11,54.29 36.29,54.11 36.8,54.11 37.79,53.12 38.29,53.12 38.47,52.94 38.47,51.82 40.02,51.27 43.41,51.27 43.59,51.09 | R109.2 43.59,49.67 43.59,51.09 | C62.1 25.62,55.29 U$24.4 26.01,54.79 26.01,54.29 26.19,54.11 26.7,54.11 27.69,53.12 28.19,53.12 28.37,52.94 28.37,51.82 29.92,51.27 33.31,51.27 | R139.2 33.49,49.67 33.49,51.09 33.31,51.27 | C45.1 68.55,52.11 68.6,52.06 68.67,52.06 68.71,52.02 v68.76,52.02 69.25,51.82 U$14.4 69.64,51.32 69.64,50.81 69.82,50.64 70.33,50.64 71.32,49.65 71.83,49.65 72,49.47 72,48.84 73.55,47.3 76.94,47.3 77.12,47.12 77.12,45.7 R66.2 | 33.31,51.27 33.66,51.27 v33.68,51.29 | 43.59,51.09 v43.78,51.29 | 53.69,51.09 v53.88,51.29 | 63.79,51.09 64.14,51.09 | 64.14,51.09 64.3,51.25 | 64.14,51.09 64.06,51.01 v64.06,51
  Top 0.203: C_SLEW_2.1 60.4,30.09 74.93,30.09 78.34,33.5 83.75,33.5 88.31,36.56 88.31,47.19 86.91,48.6 86.91,49.09 | R_PULLUP2.2 59.63,20.97 57.89,19.23 57.89,17.62 58.99,16.52 C25.2 58.15,17 48,17 | 48,17 47.75,17 48,17.25 48,19.5 | 27.49,20.01 27.67,20.19 27.69,20.19 28.31,20.81 | 27.49,20.01 27.49,12.01 28.31,11.19 28.31,6.81 28.52,6.6 29.14,6.6 29.6,6.15 41.1,6.15 41.25,6.3 | 27.49,20.01 26.97,20.53 18.97,20.53 18.5,21 17.75,21 17,21.75 17,22 | 28.31,20.81 28.75,21.25 28.75,22 | 28.31,20.81 28.31,25.2 29.11,26 48.75,26 48.75,20.24 48.88,20.11 48.88,18.66 48,17.78 48,17 | C44.1 15.52,55.29 U$25.4 15.91,54.79 15.91,54.29 16.09,54.11 16.6,54.11 17.59,53.12 18.09,53.12 18.27,52.94 18.27,51.82 19.82,51.27 23.21,51.27 23.39,51.09 23.39,49.75 22.48,48.84 R99.2
  Top 0.61: C25.2 C23.1 60.76,16.1 U2.P$5
  Top 0.813: U$7.P$4 59.53,24.34 R_PULLUP2.2
  Route2 0.203: v79.5,53.8 70.97,53.8 70.28,53.12 69.25,53.12 | 43.85,53.12 27.25,53.12 | 54.2,53.12 43.85,53.12 | 64.3,53.12 54.2,53.12 | 64.3,53.12 69.25,53.12 | 27.25,53.12 27.12,53.12 v23.62,49.62 13,39 12.94,39 v12.66,38.71 | v33.68,51.29 33.68,53.05 27.25,53.12 | v43.78,51.29 43.78,53.05 43.85,53.12 | v53.88,51.29 53.88,52.8 54.2,53.12 | v64.06,51 64.3,51.24 64.3,53.12 | 69.25,53.12 68.76,52.63 v68.76,52.02
  pour Top (isolate 0.305, no thermals): 60.78,26.78 57.48,26.78 57.48,28.3 60.78,28.3
5V  (2 unrouted)
  Top 0.203: 59,11.5 50.75,11.5 47.5,8.25
  Top 0.61: 58.84,11.52 C34.2 C32.1 60.6,11.52 U3.P$5
BDOT
  Top 1.016: R40.2 46.2,66.4 C1.1 46.2,66.6 D1.A 48.92,71.22 62.5,71.22 66.59,75.31 U$2.P$85 U$2.P$86
BUS  (3 unrouted)
  Top 0.2: C8.1 6.46,55.9 | C47.1 70.96,62.9
  Top 0.203: R19.2 11.98,44.51 13.43,45.97 13.43,55.4 12.43,56.41 10.09,56.41 9.5,57 9.5,58 8.5,59 6.5,59 | R72.2 76.48,51.51 77.93,52.97 77.93,62.4 76.93,63.41 74.59,63.41 74,64 74,65 73,66 71,66
  pour Top (no thermals): 2,55 2,60 7,60 7,57 6,56 6,55
  pour Top (no thermals): 66.5,62 66.5,67 71.5,67 71.5,64 70.5,63 70.5,62
CANH  (via drill 0.35)
  Top 0.203: BLK1.CANH 44.93,19.18 45.75,20 v45.75,20.25 | v45.75,33.4 45,34.15 45,35.25 v45.04,35.25
  Route3 0.203: v45.04,35.25 45.04,35.79 45.5,36.25 45.5,56.67 44.11,58.06 44.11,61.27 44.59,61.75 44.59,75.2 U$2.P$53 | v45.75,20.25 v45.75,33.4
CANL  (via drill 0.35)
  Top 0.203: BLK1.CANL 45.58,18.58 v46.75,19.75 | v46.75,33.57 46,34.32 v46,35.25
  Route3 0.203: v46,35.25 46,56.75 45,57.75 45,58.18 44.52,58.67 44.52,60.73 45,61.22 45,73.07 U$2.P$57 | v46.75,19.75 v46.75,33.57
COM1
  Top 1.016: R57.2 80,66.4 C28.1 80,66.6 D3.A 80,75.5 78.37,77.13 U$2.P$101 76.75,77.34 78.4,78.99 78.4,80.36 76.75,82.01 U$2.P$103
COM2  (1 unrouted)
  Top 0.203: R94.2 73.9,71 C59.1 C60.1 | 74,77 75.5,78.5 75.5,80.6 74.2,81.9 72.91,80.62 72.91,78.9 72.75,78.74 72.75,78.25 74.12,76.88 U$2.P$97
  Top 1.016: R94.2 74.9,72.8 C69.1 74.9,76.1 74,77
DEPLOY  (1 unrouted)
  Top 0.203: 78.75,17.6 78.75,9.25 D6.A
  Top 1.016: U$13.P$3 77.82,17.6 78.75,17.6 CONN2.P$2 CONN2.P$1 81.6,24.39 82.81,25.61 82.81,28.3 81.6,29.51 CONN1.P$1
  pour Top (isolate 0.305, no thermals): 76.28,15.97 76.28,19.27 77.8,19.27 77.8,15.97
EN_BDOT  (1 unrouted)
  Top 0.203: R60.2 46.7,42.5 46.7,40.73 JP5.2 | BLK1.P4.1_GPIO 14.75,15.75 14.65,15.85 14.42,15.85 12.53,17.75 12.5,17.75 11.28,18.97 11.28,25.5 18.5,32.72 47.5,32.72 47.56,32.78 JP5.1
EN_COM1  (1 unrouted)
  Top 0.203: R59.2 80.5,42.5 80.5,42 81.46,41.04 JP4.2 | BLK1.P7.3_GPIO 14.74,17.26 12.5,19.5 12.5,25 19,31.5 75,31.5 80.93,37.43 JP4.1
EN_COM2  (1 unrouted)
  Top 0.203: C49.1 74.5,53.1 R92.2 72.33,52.93 69.86,52.93 69.61,52.68 68.61,53.09 67.16,53.09 66.98,52.91 66.98,51.86 67,51.84 67,51.12 66.98,51.11 66.98,43.85 JP6.2 | BLK1.P7.4_GPIO 14.66,16.76 12.09,19.33 12.09,25.17 18.83,31.91 71,31.91 71,37.29 JP6.1
EN_DEPLOY
  Top 0.203: U$13.P$5 72.47,16.22 72.47,11.22 67.75,6.5 52.75,6.5 50.5,4.25 46.75,4.25 45.48,5.52 29.45,5.52 29.11,5.84 29.09,5.82 28.68,5.82 25.26,9.25 22.75,9.25 22.72,9.28 BLK1.P1.7_GPIO/PWM
EN_EPS  (via drill 0.35)  (1 unrouted)
  Top 0.203: R127.2 16.4,42.5 16.4,40.73 JP8.2 | BLK1.P1.6_GPIO/PWM 22.22,18.22 22.25,18.25 22.25,19.75 v22,19.75 | v12.5,29 13,29 17.25,33.25 17.25,37.34 JP8.1
  Route2 0.203: v22,19.75 21.25,20.5 21.25,23.25 15.75,28.75 12.5,28.75 v12.5,29
EN_ESTIMAT  (1 unrouted)
  Top 0.203: R120.2 36.6,42.5 36.6,40.78 JP2.2 | BLK1.P4.2_GPIO 15.01,15.26 | 15.01,15.26 15,15.25 | 15.01,15.26 14.93,15.34 14.33,15.34 10.87,18.8 10.87,25.67 18.33,33.13 37.13,33.13 37.46,33.46 JP2.1
EN_INA
  Top 0.203: U$7.P$5 60.53,22.97
EN_PPT  (1 unrouted)
  Top 0.203: C10.1 10,46.1 R28.2 7.99,46.09 2.66,46.09 2.48,45.91 2.48,42.83 3.16,42.15 JP7.2 | BLK1.P2.5_GPIO 5.49,14.26 3,16.75 3,30.27 JP7.1
EN_RAHS  (1 unrouted)
  Top 0.203: R90.2 56.8,42.5 56.8,40.73 JP3.2 | BLK1.P4.0_GPIO 14.59,16.26 11.69,19.16 11.69,25.34 18.66,32.31 57.5,32.31 57.66,32.47 JP3.1
EN_WHEEL  (2 unrouted)
  Top 0.203: R150.2 26.5,42.5 26.5,40.78 JP1.2 | BLK1.P4.3_GPIO | 17.95,14.71 17.97,14.73 15.08,14.73 | 15,14.75 15.08,14.73 | 15.08,14.73 14.27,14.83 10.47,18.63 10.47,25.84 18.16,33.53 27.25,33.53 27.25,37.27 JP1.1
EPS  (3 unrouted)
  Top 1.016: R125.2 15.9,66.4 C68.1 15.9,66.6 D11.A 21.15,73.75 31,73.75 33.57,76.32 U$2.P$36
ESTIMAT
  Top 1.016: R118.2 36.1,66.4 C52.1 36.1,66.6 D7.A 40.04,72.44 58,72.44 61.51,75.95 U$2.P$77 U$2.P$78
GND  (via drill 0.35)  (25 unrouted)
  Top 0.203: U$5.3 5.67,45.37 v5.64,45.25 | C2.2 3.29,43.39 v3.37,42.91 | v12.5,46 C10.2 C9.2 | v12.5,48 C9.2 | v12.75,50 R27.1 | v12.25,51.75 11.95,52.05 U$8.2 11.9,51.8 R27.1 | C9.2 R27.1 | v53.63,56.04 R_SLEW_1.1 | U$6.3 46.74,55.84 v46.71,55.72 47.65,56.66 | 47.65,56.66 C5.2 | 47.7,56.66 47.65,56.66 | 47.7,56.66 47.96,56.66 v48.34,56.28 | C3.2 48.9,61.4 48.9,61.45 v48.85,61.8 | 48.77,66.86 C1.2 | 48.77,66.86 v48.85,66.9 49,66.5 | C7.2 47.65,57.9 | 47.65,57.9 v46.8,57.9 | 47.65,57.9 47.7,57.85 47.7,56.66 | R2.2 50.76,66.86 48.77,66.86 | C12.2 v5.5,46.8 | C11.2 v48.9,42.1 | R4.2 v50.8,42.1 50.7,42 | v87.43,56.04 R_SLEW_3.1 | U$12.3 80.54,55.84 v80.51,55.72 81.45,56.66 | 81.45,56.66 C26.2 | 81.5,56.66 81.45,56.66 | 81.5,56.66 81.76,56.66 v82.14,56.28 | C29.2 82.7,61.4 82.7,61.45 v82.65,61.8 | 82.58,66.86 C28.2 | 82.58,66.86 v82.65,66.9 82.8,66.5 | C30.2 81.45,57.9 | 81.45,57.9 v80.6,57.9 | 81.45,57.9 81.5,57.85 81.5,56.66 | R58.2 84.56,66.86 82.58,66.86 | C31.2 v82.7,42.1 | R61.2 v84.6,42.1 84.5,42 | v63.73,56.04 R_SLEW_5.1 | U$16.3 56.84,55.84 v56.81,55.72 57.75,56.66 | 57.75,56.66 C38.2 | 57.8,56.66 57.75,56.66 | 57.8,56.66 58.06,56.66 v58.44,56.28 | C41.2 59,61.4 59,61.45 v58.95,61.8 | 58.88,66.86 C40.2 | 58.88,66.86 v58.95,66.9 59.1,66.5 | C42.2 57.75,57.9 | 57.75,57.9 v56.9,57.9 | 57.75,57.9 57.8,57.85 57.8,56.66 | R89.2 60.86,66.86 58.88,66.86 | C43.2 v59,42.1 | R91.2 v60.9,42.1 60.8,42 | v43.53,56.04 R_SLEW_7.1 | U$20.3 36.64,55.84 v36.61,55.72 37.55,56.66 | 37.55,56.66 C50.2 | 37.6,56.66 37.55,56.66 | 37.6,56.66 37.86,56.66 v38.24,56.28 | C53.2 38.8,61.4 38.8,61.45 v38.75,61.8 | 38.67,66.86 C52.2 | 38.67,66.86 v38.75,66.9 38.9,66.5 | C54.2 37.55,57.9 | 37.55,57.9 v36.7,57.9
  Top 0.203: 37.55,57.9 37.6,57.85 37.6,56.66 | R119.2 40.66,66.86 38.67,66.86 | C55.2 v38.8,42.1 | R121.2 v40.7,42.1 40.6,42 | v33.43,56.04 R_SLEW_9.1 | U$24.3 26.54,55.84 v26.51,55.72 27.45,56.66 | 27.45,56.66 C62.2 | 27.5,56.66 27.45,56.66 | 27.5,56.66 27.76,56.66 v28.14,56.28 | C65.2 28.7,61.4 28.7,61.45 v28.65,61.8 | 28.57,66.86 C64.2 | 28.57,66.86 v28.65,66.9 28.8,66.5 | C66.2 27.45,57.9 | 27.45,57.9 v26.6,57.9 | 27.45,57.9 27.5,57.85 27.5,56.66 | R149.2 30.56,66.86 28.57,66.86 | C67.2 v28.7,42.1 | R151.2 v30.6,42.1 30.5,42 | R152.2 C13.2 C14.2 | C15.2 C16.2 | U$14.3 70.17,52.37 v70.14,52.25 | C45.2 67.79,50.39 v67.87,49.91 | v77,53 C49.2 C48.2 | v77,55 C48.2 | v77.25,57 R76.1 | v76.75,58.75 76.45,59.05 U$17.2 76.4,58.8 R76.1 | C48.2 R76.1 | C56.2 v70,53.8 | R95.2 C57.2 C58.2 | C59.2 C60.2 | v63.32,28.18 R_SLEW_2.1 | v77.68,13.43 R_SLEW_4.1 | CONN1.P$4 80.8,27 v80.8,28.2 | R101.1 v23.25,29 | C98.2 24.1,23.6 24,23.5 v24,23.75 | R6.2 v45.75,2.5 | R7.2 v72.75,5 72.5,5 | v23.33,56.04 R_SLEW_8.1 | U$25.3 16.44,55.84 v16.41,55.72 17.35,56.66 | 17.35,56.66 C44.2 | 17.4,56.66 17.35,56.66 | 17.4,56.66 17.66,56.66 v18.04,56.28 | C70.2 18.6,61.4 18.6,61.45 v18.55,61.8 | 18.48,66.86 C68.2 | 18.48,66.86 v18.55,66.9 18.7,66.5 | C71.2 17.35,57.9 | 17.35,57.9 v16.5,57.9 | 17.35,57.9 17.4,57.85 17.4,56.66 | R126.2 20.46,66.86 18.48,66.86 | C72.2 v18.6,42.1 | R128.2 v20.5,42.1 20.4,42
  Top 0.61: U2.P$2 v66.11,17.05 v66.11,17.69 | v58.58,18.73 58.99,18.31 C25.1 59.21,18.17 v59.21,18.73 | v64.86,22.22 64.86,21.73 C24.1 65.15,21.88 v65.5,22.22 | U3.P$2 v66.02,12.47 v66.02,13.1 | v59.13,14.09 58.84,13.8 C34.1 58.84,13.75 v58.49,14.09 | v65.61,7.8 65.61,8.24 C33.1 65.32,8.15 v64.97,7.8
  Top 1.016: CONN2.P$4 CONN2.P$3 | CONN1.P$3 CONN1.P$4
  other vias: 9.81,37.68 53.63,56.67 50.58,48.45 48.85,61.1 48.85,66.3 48.34,56.98 51.23,48.45 5.5,47.4 87.43,56.67 84.38,48.45 82.65,61.1 82.65,66.3 82.14,56.98 85.03,48.45 63.73,56.67 60.68,48.45 58.95,61.1 58.95,66.3 58.44,56.98 61.33,48.45 43.53,56.67 40.48,48.45 38.75,61.1 38.75,66.3 38.24,56.98 41.13,48.45 33.43,56.67 30.38,48.45 28.65,61.1 28.65,66.3 28.14,56.98 31.03,48.45 4.45,63.75 4.45,64.45 4.85,62.95 13.15,63.05 13.65,63.65 13.65,62.45 74.31,44.68 70,54.4 68.95,70.75 68.95,71.45 69.35,69.95 77.65,70.05 78.15,70.65 78.15,69.45 62.69,28.18 77.68,14.06 80.8,27.5 80.8,26.8 80.8,26.2 80.9,14.2 80.9,14.9 80.9,15.6 80.9,16.2 23.33,56.67 20.28,48.45 18.55,61.1 18.55,66.3 18.04,56.98 20.93,48.45 10.55,67.05 11.15,67.45 11.15,68.05 11.15,68.75 11.15,69.35 3.75,67.05 2.95,67.45 2.95,68.05 2.95,68.65 2.95,69.35 2.45,76.75 2.45,77.35 2.45,77.95
  pour Bottom: 14.5,74.3 14.45,52.4 0,52.4 0,-1 72,0 90,0 90,85 85,90 5,90 0,85 0,53 13.9,53 13.9,74.25
INA219_A0_1
  Top 0.203: U$5.7 6.2,41.96 6.2,42.47 6.03,42.65 4.67,42.65 4.28,42.25 4.28,37.34 6.37,35.26 | 6.37,35.26 R15.1 R18.1 R17.1 | 6.37,35.26 R16.1
INA219_A0_2
  Top 0.203: U$6.7 47.27,52.43 47.27,52.94 47.09,53.12 45.74,53.12 45.35,52.73 45.35,48.31 47.44,46.23 | 47.44,46.23 R30.1 R33.1 R32.1 | 47.44,46.23 R31.1
INA219_A0_4
  Top 0.203: U$12.7 81.07,52.43 81.07,52.94 80.89,53.12 79.54,53.12 79.15,52.73 79.15,48.31 81.24,46.23 | 81.24,46.23 R50.1 R53.1 R52.1 | 81.24,46.23 R51.1
INA219_A0_5
  Top 0.203: U$14.7 70.7,48.96 70.7,49.47 70.53,49.65 69.17,49.65 68.78,49.25 68.78,44.34 70.87,42.26 | 70.87,42.26 R68.1 R71.1 R70.1 | 70.87,42.26 R69.1
INA219_A0_6
  Top 0.203: U$16.7 57.37,52.43 57.37,52.94 57.19,53.12 55.84,53.12 55.45,52.73 55.45,48.31 57.54,46.23 | 57.54,46.23 R81.1 R84.1 R83.1 | 57.54,46.23 R82.1
INA219_A0_7
  Top 0.203: U$25.7 16.97,52.43 16.97,52.94 16.79,53.12 15.44,53.12 15.05,52.73 15.05,48.31 17.14,46.23 | 17.14,46.23 R103.1 R106.1 R105.1 | 17.14,46.23 R104.1
INA219_A0_8
  Top 0.203: U$20.7 37.17,52.43 37.17,52.94 36.99,53.12 35.64,53.12 35.25,52.73 35.25,48.31 37.34,46.23 | 37.34,46.23 R111.1 R114.1 R113.1 | 37.34,46.23 R112.1
INA219_A0_10
  Top 0.203: U$24.7 27.07,52.43 27.07,52.94 26.89,53.12 25.54,53.12 25.15,52.73 25.15,48.31 27.24,46.23 | 27.24,46.23 R141.1 R144.1 R143.1 | 27.24,46.23 R142.1
INA219_A1_1
  Top 0.203: R13.1 R14.1 R11.1 7.27,39.6 | R12.1 7.27,39.6 | U$5.8 6.98,39.89 7.27,39.6
INA219_A1_2
  Top 0.203: R24.1 R29.1 R22.1 48.34,50.57 | R23.1 48.34,50.57 | U$6.8 48.04,50.86 48.34,50.57
INA219_A1_4
  Top 0.203: R48.1 R49.1 R46.1 82.14,50.57 | R47.1 82.14,50.57 | U$12.8 81.84,50.86 82.14,50.57
INA219_A1_5
  Top 0.203: R66.1 R67.1 R64.1 71.77,46.6 | R65.1 71.77,46.6 | U$14.8 71.47,46.89 71.77,46.6
INA219_A1_6
  Top 0.203: R79.1 R80.1 R77.1 58.44,50.57 | R78.1 58.44,50.57 | U$16.8 58.14,50.86 58.44,50.57
INA219_A1_7
  Top 0.203: R99.1 R102.1 R97.1 18.04,50.57 | R98.1 18.04,50.57 | U$25.8 17.74,50.86 18.04,50.57
INA219_A1_8
  Top 0.203: R109.1 R110.1 R107.1 38.24,50.57 | R108.1 38.24,50.57 | U$20.8 37.94,50.86 38.24,50.57
INA219_A1_10
  Top 0.203: R139.1 R140.1 R137.1 28.14,50.57 | R138.1 28.14,50.57 | U$24.8 27.84,50.86 28.14,50.57
INA219_IN+_1
  Top 0.203: U$5.1 7.38,44.04 C4.1 8.91,44.11 R19.1
INA219_IN+_2
  Top 0.203: U$6.1 48.44,54.51 C6.1 49.98,54.48 R34.1
INA219_IN+_4
  Top 0.203: U$12.1 82.24,54.51 C27.1 83.78,54.48 R54.1
INA219_IN+_5
  Top 0.203: U$14.1 71.88,51.04 C46.1 73.41,51.11 R72.1
INA219_IN+_6
  Top 0.203: U$16.1 58.54,54.51 C39.1 60.08,54.48 R85.1
INA219_IN+_7
  Top 0.203: U$25.1 18.14,54.51 C61.1 19.68,54.48 R122.1
INA219_IN+_8
  Top 0.203: U$20.1 38.34,54.51 C51.1 39.88,54.48 R115.1
INA219_IN+_10
  Top 0.203: U$24.1 28.24,54.51 C63.1 29.78,54.48 R145.1
INA219_IN-_1
  Top 0.203: 8.54,42.51 C4.2 | C4.2 8.91,41.87 R20.1 | C4.2 7.15,43.64 6.62,43.64 6.45,43.81 6.45,44.32 U$5.2
INA219_IN-_2
  Top 0.203: 49.61,52.98 C6.2 | C6.2 50.18,52.54 R35.1 | C6.2 48.21,54.11 47.69,54.11 47.51,54.29 47.51,54.79 U$6.2
INA219_IN-_4
  Top 0.203: 83.41,52.98 C27.2 | C27.2 83.98,52.54 R55.1 | C27.2 82.01,54.11 81.49,54.11 81.31,54.29 81.31,54.79 U$12.2
INA219_IN-_5
  Top 0.203: 73.04,49.51 C46.2 | C46.2 73.41,48.87 R73.1 | C46.2 71.64,50.64 71.12,50.64 70.94,50.81 70.94,51.32 U$14.2
INA219_IN-_6
  Top 0.203: 59.71,52.98 C39.2 | C39.2 60.28,52.54 R86.1 | C39.2 58.31,54.11 57.79,54.11 57.61,54.29 57.61,54.79 U$16.2
INA219_IN-_7
  Top 0.203: 19.31,52.98 C61.2 | C61.2 19.88,52.54 R123.1 | C61.2 17.91,54.11 17.39,54.11 17.21,54.29 17.21,54.79 U$25.2
INA219_IN-_8
  Top 0.203: 39.51,52.98 C51.2 | C51.2 40.08,52.54 R116.1 | C51.2 38.11,54.11 37.59,54.11 37.41,54.29 37.41,54.79 U$20.2
INA219_IN-_10
  Top 0.203: 29.41,52.98 C63.2 | C63.2 29.98,52.54 R146.1 | C63.2 28.01,54.11 27.49,54.11 27.31,54.29 27.31,54.79 U$24.2
LDO_3V3_BYP2
  Top 0.61: U2.P$4 60.76,18 C23.2
LDO_5V_BYP2
  Top 0.61: U3.P$4 60.6,13.42 C32.2
LOAD  (1 unrouted)
  Top 0.203: R20.2 12.69,42.58 12.69,44.64 13.84,45.8 13.84,55.57 12.59,56.81 10.26,56.81 10.04,57.04 10.04,58.14 10.3,58.4 11.3,58.4 R1.2 | R73.2 77.19,49.58 77.19,51.64 78.34,52.8 78.34,62.57 77.09,63.81 74.76,63.81 74.54,64.04 74.54,65.14 74.8,65.4 75.8,65.4 R93.2
  pour Top (no thermals): 9,61 7.2,61 7.2,64.5 9,62
  pour Top (no thermals): 11.4,58.5 9,61 9.8,62.2 12.4,59.9 12,60
  pour Top (no thermals): 73.5,68 71.7,68 71.7,71.5 73.5,69
  pour Top (no thermals): 75.9,65.5 73.5,68 74.3,69.2 76.9,66.9 76.5,67
N$1
  Top 0.2: R25.1 C8.2
  Top 0.203: U$9.G 7.6,51.9 R25.1 | C8.2 8.7,54.1 R26.1
N$2
  Top 0.203: U$8.1 10.35,50.25 R27.2 C9.1 10,47.9 R28.1
N$3
  Top 0.203: R2.1 49.5,68.8 D1.C
N$4
  Top 0.203: U$11.P$5 50.89,58.66 46.35,58.66 45.08,57.39 45.08,55.94 45.11,54.81 44.94,54.65 44.94,46.92 47.1,44.76 R60.1 C11.1 R4.1
N$5
  Top 0.203: R5.2 R101.2 R100.1
N$6
  Top 0.203: U$8.3 11.2,53.95 12.25,55 12.25,55.15 R26.2
N$7
  Top 0.203: BLK1.P1.0_A0 26.75,21.64 26.75,23.75 26,24.5 C98.1 24.1,26.3 R5.1
N$8
  Top 0.203: U$7.P$1 62.16,27.31 62.16,26.77 62.82,26.12 R_SLEW_2.2
N$9
  Top 0.203: U$11.P$1 52.76,57.2 52.22,57.2 51.57,56.55 R_SLEW_1.2
N$10
  Top 0.203: C_SLEW_1.2 51.33,60.6 51.78,60.16 51.78,58.51 51.54,58.27 51.51,58.27 U$11.P$6 49.79,57.83 R_PULLUP1.1
N$11
  Top 0.203: C_SLEW_2.2 58.76,25.88 59.21,26.33 60.85,26.33 61.09,26.09 61.09,26.06 U$7.P$6 61.53,24.34 R_PULLUP2.1
N$12
  Top 0.203: U$10.P$1 86.56,57.2 86.02,57.2 85.37,56.55 R_SLEW_3.2
N$13
  Top 0.203: C_SLEW_3.2 85.13,60.6 85.58,60.16 85.58,58.51 85.34,58.27 85.31,58.27 U$10.P$6 83.59,57.83 R_PULLUP3.1
N$14
  Top 0.203: R58.1 83.3,68.8 D3.C
N$15
  Top 0.203: U$10.P$5 84.69,58.66 80.15,58.66 78.88,57.39 78.88,55.94 78.91,54.81 78.74,54.65 78.74,46.92 80.9,44.76 R59.1 C31.1 R61.1
N$16
  Top 0.2: R74.1 C47.2
  Top 0.203: U$18.G 72.1,58.9 R74.1 | C47.2 73.2,61.1 R75.1
N$17
  Top 0.203: U$17.1 74.85,57.25 R76.2 C48.1 74.5,54.9 R92.1
N$18
  Top 0.203: U$17.3 75.7,60.95 76.75,62 76.75,62.15 R75.2
N$19
  Top 0.203: D4.C 66.6,69.4 R95.1
N$20
  Top 0.203: U$15.P$1 62.86,57.2 62.32,57.2 61.67,56.55 R_SLEW_5.2
N$21
  Top 0.203: C_SLEW_5.2 61.43,60.6 61.88,60.16 61.88,58.51 61.64,58.27 61.61,58.27 U$15.P$6 59.89,57.83 R_PULLUP5.1
N$22
  Top 0.203: R89.1 59.6,68.8 D5.C
N$23
  Top 0.203: U$15.P$5 60.99,58.66 56.45,58.66 55.18,57.39 55.18,55.94 55.21,54.81 55.04,54.65 55.04,46.92 57.2,44.76 R90.1 C43.1 R91.1
N$24
  Top 0.203: BLK1.P3.5_GPIO_DEBUG 20.79,10.34 20.79,9.51 26.18,4.12 31,4.12 | U$1.8 32.93,2.21 31.03,4.12 31,4.12 | 31,4.12 36.38,4.12 D2.A
N$25
  Top 0.203: BLK1.P3.4_GPIO_DEBUG 20.25,10.38 20.25,9.25 25.79,3.71 28.64,3.71 29.89,2.47 U$1.7
N$26  (1 unrouted)
  Top 0.203: BLK1.P2.1_RXD 19.25,10.38 19.25,9.5 23.5,5.25 23.5,1.75
N$27
  Top 0.203: BLK1.P2.0_TXD 18.79,10.84 18.79,9.38 20.76,7.41 U$1.3
N$28
  Top 0.203: U$19.P$1 42.66,57.2 42.12,57.2 41.47,56.55 R_SLEW_7.2
N$29
  Top 0.203: C_SLEW_7.2 41.23,60.6 41.68,60.16 41.68,58.51 41.44,58.27 41.41,58.27 U$19.P$6 39.69,57.83 R_PULLUP7.1
N$30
  Top 0.203: R119.1 39.4,68.8 D7.C
N$31
  Top 0.203: U$19.P$5 40.79,58.66 36.25,58.66 34.98,57.39 34.98,55.94 35.01,54.81 34.84,54.65 34.84,46.92 37,44.76 R120.1 C55.1 R121.1
N$32
  Top 0.203: BLK1.SBWTDIO 16.5,12.75 16.5,12.72 16.29,12.51 16.29,12.01 18.22,10.08 U$1.2
N$33
  Top 0.203: BLK1.SBWTCK 16.25,13.25 16.25,13.07 15.88,12.71 15.88,2.67 U$1.SBWTCK
N$34
  Top 0.203: U$13.P$1 76.81,14.59 76.27,14.59 75.62,13.93 R_SLEW_4.2
N$35
  Top 0.203: C_SLEW_4.2 75.38,17.99 75.83,17.54 75.83,15.9 75.59,15.66 75.56,15.66 U$13.P$6 73.84,15.22 R_PULLUP4.1
N$36
  Top 0.203: U$23.P$1 32.56,57.2 32.02,57.2 31.37,56.55 R_SLEW_9.2
N$37
  Top 0.203: C_SLEW_9.2 31.13,60.6 31.58,60.16 31.58,58.51 31.34,58.27 31.31,58.27 U$23.P$6 29.59,57.83 R_PULLUP9.1
N$38
  Top 0.203: R149.1 29.3,68.8 D9.C
N$39
  Top 0.203: U$23.P$5 30.69,58.66 26.15,58.66 24.88,57.39 24.88,55.94 24.91,54.81 24.74,54.65 24.74,46.92 26.9,44.76 R150.1 C67.1 R151.1
N$40
  Top 0.203: D10.C 2.1,62.4 R152.1
N$41
  Top 0.203: 28.5,6.75 28.75,7 28.75,7.5
N$42
  Top 0.203: 41.25,6.25 41.75,6.75 41.75,7
N$43
  Top 0.203: D2.C R6.1
N$45
  Top 0.203: D6.C R7.1
N$50
  Top 0.203: U$22.P$1 22.46,57.2 21.92,57.2 21.27,56.55 R_SLEW_8.2
N$51
  Top 0.203: C_SLEW_8.2 21.03,60.6 21.48,60.16 21.48,58.51 21.24,58.27 21.21,58.27 U$22.P$6 19.49,57.83 R_PULLUP8.1
N$52
  Top 0.203: R126.1 19.2,68.8 D11.C
N$53
  Top 0.203: U$22.P$5 20.59,58.66 16.05,58.66 14.78,57.39 14.78,55.94 14.81,54.81 14.64,54.65 14.64,46.92 16.8,44.76 R127.1 C72.1 R128.1
OUT_1  (1 unrouted)
  Top 0.203: R34.2 53.05,54.49 54.31,55.75 54.31,56.95 54.05,57.22 54.05,58.1 54.2,58.25 54.2,65.75 50.95,65.75 50.95,65 52.7,65 52.95,65.25
  pour Top (isolate 0.305, no thermals): 52.23,58.58 52.23,64.88 53.62,64.88 53.7,63 53.75,58.58
OUT_3  (1 unrouted)
  Top 0.203: R54.2 86.85,54.49 88.11,55.75 88.11,56.95 87.85,57.22 87.85,58.1 88,58.25 88,65.75 84.75,65.75 84.75,65 86.5,65 86.75,65.25
  pour Top (isolate 0.305, no thermals): 86.03,58.58 86.03,64.88 87.42,64.88 87.5,63 87.55,58.58
OUT_4  (1 unrouted)
  Top 0.203: R122.2 22.75,54.49 24.01,55.75 24.01,56.95 23.75,57.22 23.75,58.1 23.9,58.25 23.9,65.75 20.65,65.75 20.65,65 22.4,65 22.65,65.25
  pour Top (isolate 0.305, no thermals): 21.93,58.58 21.93,64.88 23.32,64.88 23.4,63 23.45,58.58
OUT_5  (1 unrouted)
  Top 0.203: R85.2 63.15,54.49 64.41,55.75 64.41,56.95 64.15,57.22 64.15,58.1 64.3,58.25 64.3,65.75 61.05,65.75 61.05,65 62.8,65 63.05,65.25
  pour Top (isolate 0.305, no thermals): 62.33,58.58 62.33,64.88 63.72,64.88 63.8,63 63.85,58.58
OUT_7  (1 unrouted)
  Top 0.203: R115.2 42.95,54.49 44.21,55.75 44.21,56.95 43.95,57.22 43.95,58.1 44.1,58.25 44.1,65.75 40.85,65.75 40.85,65 42.6,65 42.85,65.25
  pour Top (isolate 0.305, no thermals): 42.13,58.58 42.13,64.88 43.52,64.88 43.6,63 43.65,58.58
OUT_9  (1 unrouted)
  Top 0.203: R145.2 32.85,54.49 34.11,55.75 34.11,56.95 33.85,57.22 33.85,58.1 34,58.25 34,65.75 30.75,65.75 30.75,65 32.5,65 32.75,65.25
  pour Top (isolate 0.305, no thermals): 32.03,58.58 32.03,64.88 33.42,64.88 33.5,63 33.55,58.58
OUTPUT1  (1 unrouted)
  Top 0.203: R35.2 53.05,52.82 53.75,53.52 53.75,54.62 54.72,55.59 54.72,57.12 54.45,57.39 54.45,57.93 54.61,58.08 54.61,64.67 54.62,66.16 50.78,66.16 50.54,65.92 50.54,65.09 50.45,65 48.95,65
  Top 1.016: R36.1 48.55,63.95 47.26,63.95 47.09,63.79 46.89,63.79 R40.1 46.2,61.5 C3.1
OUTPUT3  (1 unrouted)
  Top 0.203: R55.2 86.85,52.82 87.55,53.52 87.55,54.62 88.52,55.59 88.52,57.12 88.25,57.39 88.25,57.93 88.41,58.08 88.41,64.67 88.42,66.16 84.58,66.16 84.34,65.92 84.34,65.09 84.25,65 82.75,65
  Top 1.016: R56.1 82.35,63.95 81.06,63.95 80.9,63.79 80.69,63.79 R57.1 80,61.5 C29.1
OUTPUT4  (1 unrouted)
  Top 0.203: R123.2 22.75,52.82 23.45,53.52 23.45,54.62 24.42,55.59 24.42,57.12 24.15,57.39 24.15,57.93 24.31,58.08 24.31,64.67 24.32,66.16 20.48,66.16 20.24,65.92 20.24,65.09 20.15,65 18.65,65
  Top 1.016: R124.1 18.25,63.95 16.96,63.95 16.8,63.79 16.59,63.79 R125.1 15.9,61.5 C70.1
OUTPUT5  (1 unrouted)
  Top 0.203: R86.2 63.15,52.82 63.85,53.52 63.85,54.62 64.82,55.59 64.82,57.12 64.55,57.39 64.55,57.93 64.71,58.08 64.71,64.67 64.72,66.16 60.88,66.16 60.64,65.92 60.64,65.09 60.55,65 59.05,65
  Top 1.016: R87.1 58.65,63.95 57.36,63.95 57.2,63.79 56.99,63.79 R88.1 56.3,61.5 C41.1
OUTPUT7  (1 unrouted)
  Top 0.203: R116.2 42.95,52.82 43.65,53.52 43.65,54.62 44.62,55.59 44.62,57.12 44.35,57.39 44.35,57.93 44.51,58.08 44.51,64.67 44.52,66.16 40.68,66.16 40.44,65.92 40.44,65.09 40.35,65 38.85,65
  Top 1.016: R117.1 38.45,63.95 37.16,63.95 36.99,63.79 36.79,63.79 R118.1 36.1,61.5 C53.1
OUTPUT9  (1 unrouted)
  Top 0.203: R146.2 32.85,52.82 33.55,53.52 33.55,54.62 34.52,55.59 34.52,57.12 34.25,57.39 34.25,57.93 34.41,58.08 34.41,64.67 34.42,66.16 30.58,66.16 30.34,65.92 30.34,65.09 30.25,65 28.75,65
  Top 1.016: R147.1 28.35,63.95 27.06,63.95 26.89,63.79 26.69,63.79 R148.1 26,61.5 C65.1
PPT
  Top 0.203: R3.2 9.4,64 C15.1 C16.1
  pour Top: 9.5,64.5 9.5,71 14,75.5 22,75.5 22,86.5 11.5,86.5 5,80 5,76 2,73 2,71.5 9,64.5
RAHS
  Top 1.016: R88.2 56.3,66.4 C40.1 56.3,66.6 D5.A 57.8,70 64.5,70 65.49,70.99 65.49,71.89 66.34,72.75 70.75,72.75 71.67,73.67 U$2.P$93
SCL  (via drill 0.35)  (16 unrouted)
  Top 0.203: U$5.5 5.02,41.6 4.69,41.26 4.69,38.9 5.1,38.48 5.31,38.48 R12.2 7,36.8 7,36.53 7.57,35.96 8.63,35.96 8.65,35.95 12.52,35.95 12.62,35.79 12.62,34.73 12.1,34.22 7.72,34.22 6.48,32.97 JP7.4 | U$6.5 46.09,52.07 45.76,51.74 45.76,49.87 46.17,49.46 46.38,49.46 R23.2 48.07,47.77 48.07,47.5 48.64,46.93 49.7,46.93 49.71,46.92 53.64,46.92 53.7,46.86 53.7,42 52.23,42 JP5.4 | U$12.5 79.89,52.07 79.56,51.74 79.56,49.87 79.97,49.46 80.18,49.46 R47.2 81.87,47.77 81.87,47.5 82.44,46.93 83.5,46.93 83.51,46.92 87.44,46.92 87.5,46.86 87.5,42 86.72,41.22 86.02,41.22 84.78,39.97 JP4.4 | U$16.5 56.19,52.07 55.86,51.74 55.86,49.87 56.27,49.46 56.48,49.46 R78.2 58.17,47.77 58.17,47.5 58.74,46.93 59.8,46.93 59.81,46.92 63.74,46.92 63.8,46.86 63.8,42 62.33,42 JP3.4 | U$20.5 35.99,52.07 35.66,51.74 35.66,49.87 36.07,49.46 36.28,49.46 R108.2 37.97,47.77 37.97,47.5 38.54,46.93 39.6,46.93 39.61,46.92 43.54,46.92 43.6,46.86 43.6,42 42.08,42 JP2.4 | U$24.5 25.89,52.07 25.56,51.74 25.56,49.87 25.97,49.46 26.18,49.46 R138.2 27.87,47.77 27.87,47.5 28.44,46.93 29.5,46.93 29.51,46.92 33.44,46.92 33.5,46.86 33.5,42 31.98,42 JP1.4 | U$14.5 69.53,48.6 69.19,48.26 69.19,45.9 69.61,45.48 69.81,45.48 R65.2 71.5,43.8 71.5,43.53 72.07,42.96 73.13,42.96 73.15,42.95 77.02,42.95 77.12,42.79 77.12,41.73 76.61,41.22 75.42,41.22 74.18,39.97 JP6.4 | v22.25,25.75 22.25,21.64 BLK1.P7.1_I2C-SCL-2 | U$25.5 15.79,52.07 15.46,51.74 15.46,49.87 15.87,49.46 16.08,49.46 R98.2 17.77,47.77 17.77,47.5 18.34,46.93 19.4,46.93 19.41,46.92 23.34,46.92 23.4,46.86 23.4,42 22.61,41.22 21.72,41.22 20.48,39.97 JP8.4
  Route3 0.203: JP7.3 5.5,30.23 5.5,28.5 10.75,28.5 12,29.75 17.25,29.75 | 20,32.5 17.25,29.75 | 20,32.5 22.8,35.35 30.1,35.35 | JP4.3 78.82,33.75 70.75,33.75 | 56.25,33.75 70.75,33.75 | 47.5,34.25 56.25,33.75 | 39.75,34.25 47.5,34.25 | 30.1,35.35 39.75,34.25 | JP6.3 73.4,33.9 70.75,33.75 | JP3.3 60.4,33.9 56.25,33.75 | JP5.3 50.4,33.85 47.5,34.25 | JP2.3 39.85,34.45 39.75,34.25 | JP1.3 29.8,35.65 30.1,35.35 | 17.25,29.75 21.25,25.75 v22.25,25.75 | JP8.3 19.7,32.8 20,32.5
SDA  (via drill 0.35)  (16 unrouted)
  Top 0.203: U$5.6 5.67,40.7 5.09,40.12 5.09,39.07 5.27,38.89 6.81,38.89 R11.2 8.91,36.8 8.91,36.53 9.08,36.35 12.75,36.35 12.95,36.25 13.18,35.98 13.18,34.72 12.27,33.81 9.08,33.81 JP7.6 | U$6.6 46.74,51.67 46.16,51.09 46.16,50.04 46.34,49.86 47.88,49.86 R22.2 49.97,47.77 49.97,47.5 50.15,47.32 53.81,47.32 54.11,47.03 54.11,41.34 JP5.6 | U$12.6 80.54,51.67 79.96,51.09 79.96,50.04 80.14,49.86 81.68,49.86 R46.2 83.77,47.77 83.77,47.5 83.95,47.32 87.61,47.32 87.91,47.03 87.91,41.34 JP4.6 | U$16.6 56.84,51.67 56.26,51.09 56.26,50.04 56.44,49.86 57.98,49.86 R77.2 60.07,47.77 60.07,47.5 60.25,47.32 63.91,47.32 64.21,47.03 64.21,41.34 JP3.6 | U$20.6 36.64,51.67 36.06,51.09 36.06,50.04 36.24,49.86 37.78,49.86 R107.2 39.87,47.77 39.87,47.5 40.05,47.32 43.71,47.32 44.01,47.03 44.01,41.83 42.54,40.37 JP2.6 | U$24.6 26.54,51.67 25.96,51.09 25.96,50.04 26.14,49.86 27.68,49.86 R137.2 29.77,47.77 29.77,47.5 29.95,47.32 33.61,47.32 33.91,47.03 33.91,41.39 JP1.6 | U$14.6 70.17,47.7 69.59,47.12 69.59,46.07 69.77,45.89 71.31,45.89 R64.2 73.41,43.8 73.41,43.53 73.58,43.35 77.4,43.35 77.5,43.25 77.5,42.98 77.53,42.96 77.53,42.91 77.55,42.86 77.53,42.74 77.53,41.56 JP6.6 | v22.75,27 22.75,26.22 22.93,26.03 22.93,25.47 22.75,25.28 22.75,21.64 BLK1.P7.0_I2C-SDA-2 | U$25.6 16.44,51.67 15.86,51.09 15.86,50.04 16.04,49.86 17.58,49.86 R97.2 19.67,47.77 19.67,47.5 19.85,47.32 23.51,47.32 23.81,47.03 23.81,41.54 JP8.6
  Route2 0.203: JP7.5 16.68,30.43 | 16.68,30.43 20.75,34.5 22.5,35.4 | 59.25,34.5 73.75,34.5 | 48,34.5 59.25,34.5 | 37,34.5 48,34.5 | 32.15,35.4 37,34.5 | 22.5,35.4 32.15,35.4 | 73.75,34.5 84.11,34.5 JP4.5 | JP6.5 75.94,34.41 73.75,34.5 | JP3.5 62.84,34.51 59.25,34.5 | JP5.5 52.74,34.56 48,34.5 | JP2.5 42.64,34.56 37,34.5 | JP1.5 32.25,37.07 32.15,35.4 | 16.68,30.43 19.32,30.43 v22.75,27 | JP8.5 22.5,37.17 22.5,35.4
SYNC1  (via drill 0.35)
  Top 0.203: BLK1.P7.2_SYNC1 14.99,17.76 13,19.75 13,24.93 19.17,31.09 22.5,31.09 22.75,30.84 v22.75,30.75 | v23.75,34.25 23.75,36 v24.25,36.5
  Route3 0.203: 41.19,76.5 41.19,75.8 | 41.19,76.5 U$2.P$45 | v22.75,30.75 23.25,31.25 23.25,34 23.5,34.25 v23.75,34.25 | v24.25,36.5 24.25,49.28 24.31,49.34 24.31,49.91 24.25,49.97 24.25,57 23.5,57.75 23.5,71.5 25.5,73.5 40.5,73.5 41.19,74.19 41.19,76.5
SYNC2  (via drill 0.35)
  Top 0.203: BLK1.PJ.3_SYNC2 15.25,18.25 13.5,20 13.41,20 13.41,24.76 19.2,30.55 21.45,30.55 v22.45,29.55 | v25.5,34.22 25.5,36.5 v25.25,36.75
  Route3 0.203: v22.45,29.55 22.96,30.07 23.03,30.07 25.5,32.53 v25.5,34.22 | v25.5,34.22 25.5,34.25 v25.5,34.22 | v25.25,36.75 25.25,57.53 24.32,58.47 24.32,71.43 24.25,71.5 39.08,71.5 41.6,74.02 41.6,74.75 U$2.P$49
VBAT  (via drill 0.35)  (18 unrouted)
  Top 0.203: U$9.S3 4.66,50.2 5.47,49.39 6.34,49.39 7.05,50.1 R25.2 | C12.1 3,47.1 3,49.84 U$9.S2 | U$18.S3 69.16,57.2 69.97,56.39 70.84,56.39 71.55,57.1 R74.2 | C56.1 67.5,54.1 67.5,56.84 U$18.S2 | R100.2 50,29 v57.75,21.25
  Top 0.254: U2.P$3 | C24.2 65.02,19.48 64.91,19.36 | U3.P$1
  Top 0.508: U2.P$1
  Top 0.61: U2.P$3 63.56,18 63.56,16.1 U2.P$1 | 64.91,19.36 U2.P$3 | U3.P$1 63.48,11.52 63.48,13.42 U3.P$3 | U3.P$1 64.83,10.87 C33.2
  Top 0.813: U$11.P$4 49.79,59.83 R_PULLUP1.2 | U$10.P$4 83.59,59.83 R_PULLUP3.2 | U$15.P$4 59.89,59.83 R_PULLUP5.2 | U$19.P$4 39.69,59.83 R_PULLUP7.2 | U$23.P$4 29.59,59.83 R_PULLUP9.2 | U$13.P$4 73.84,17.22 R_PULLUP4.2 | U$22.P$4 19.49,59.83 R_PULLUP8.2
  Top 1.016: R_PULLUP1.2 45.97,59.73 | R_PULLUP3.2 79.77,59.73 | R_PULLUP5.2 56.07,59.73 | R_PULLUP7.2 35.87,59.73 | R_PULLUP9.2 25.77,59.73 | C33.2 66.31,11.38 66.47,11.38 67.1,12.02 67.1,13.55 67,13.66 67,16.41 67.19,16.6 67.19,18.14 | 67.19,18.14 v66.56,18.78 | v66.56,18.78 65.73,18.78 65.02,19.48 | C24.2 65.69,19.64 v66.56,18.78 | R_PULLUP4.2 72.72,18.14 67.19,18.14 | R_PULLUP8.2 15.67,59.73
  Route2 0.203: v57.75,21.25 69,21.25 69.02,21.23
  Route2 1.016: v66.56,18.78 69.02,21.23 80.78,33 84,33 89.5,38 89.5,59.25
  other vias: 25,60.25 25.6,59.9 26.25,59.9 26.25,59.4 25.6,59.35 25,58.75 25,59.5 35.1,60.25 35.7,59.9 36.35,59.9 36.35,59.4 35.7,59.35 35.1,58.75 35.1,59.5 45.2,60.45 45.8,60.1 46.45,60.1 46.45,59.6 45.8,59.55 45.2,58.95 45.2,59.7 55.3,60.5 55.9,60.15 56.55,60.15 56.55,59.65 55.9,59.6 55.3,59 55.3,59.75 79.1,60.35 79.6,60 80.25,60 80.25,59.5 79.6,59.45 79.1,58.85 79.1,59.6 65.7,56.35 66.3,56 66.95,56 66.95,55.5 66.3,55.45 65.7,54.85 65.7,55.6 66.4,54.85 67,54.85 65.7,57.05 67.65,56 68.35,56 67.65,55.5 68.35,55.4 1.2,49.55 1.8,49.2 2.45,49.2 2.45,48.7 1.8,48.65 1.2,48.05 1.2,48.8 3.2,49.2 3.95,49.2 4.7,49.2 4.7,48.45 3.95,48.45 3.2,48.45 1.2,50.2 5.45,48.45 5.45,49.2 6.2,49.2 6.2,48.45 67.06,19.23 67.16,18.53 66.36,19.43 66.76,19.83 67.46,19.73 67.66,19.13 16.1,60.05 16.1,59.45 15.4,59.45 15.4,60.15 14.8,60.15 14.8,59.45
  pour Top (no thermals): 2,50.5 2,48.5 4.5,48.5 4.5,50.5
  pour Top (no thermals): 66.5,57.5 66.5,55.5 69,55.5 69,57.5
  pour Route2: 14.4,74.3 14.3,63.6 14.35,57.5 65.05,57.5 65.4,53.5 68.7,53.5 72.75,57.25 90,57.5 90,85 85,90 5,90 0,85 0,48 7.4,48 13.2,63.2 13.8,74.2
WHEEL
  Top 1.016: R148.2 26,66.4 C64.1 26,66.6 D9.A 30,72.5 38.38,72.5 39.53,73.66 54.25,73.66 56.43,75.84 U$2.P$69 U$2.P$70

## Text on the board
tSilk: COM2 | EPS | WHEEL | ESTIMAT | BDOT | RAHS | COM1 | PPT | EN / SCL / SDA | EN / SCL / SDA | EN / SCL / SDA | EN / SCL / SDA | EN / SCL / SDA | EN / SCL / SDA | EN / SCL / SDA